# Altium project ThereMightBeNoise.PrjPCB (part 1 of 2)
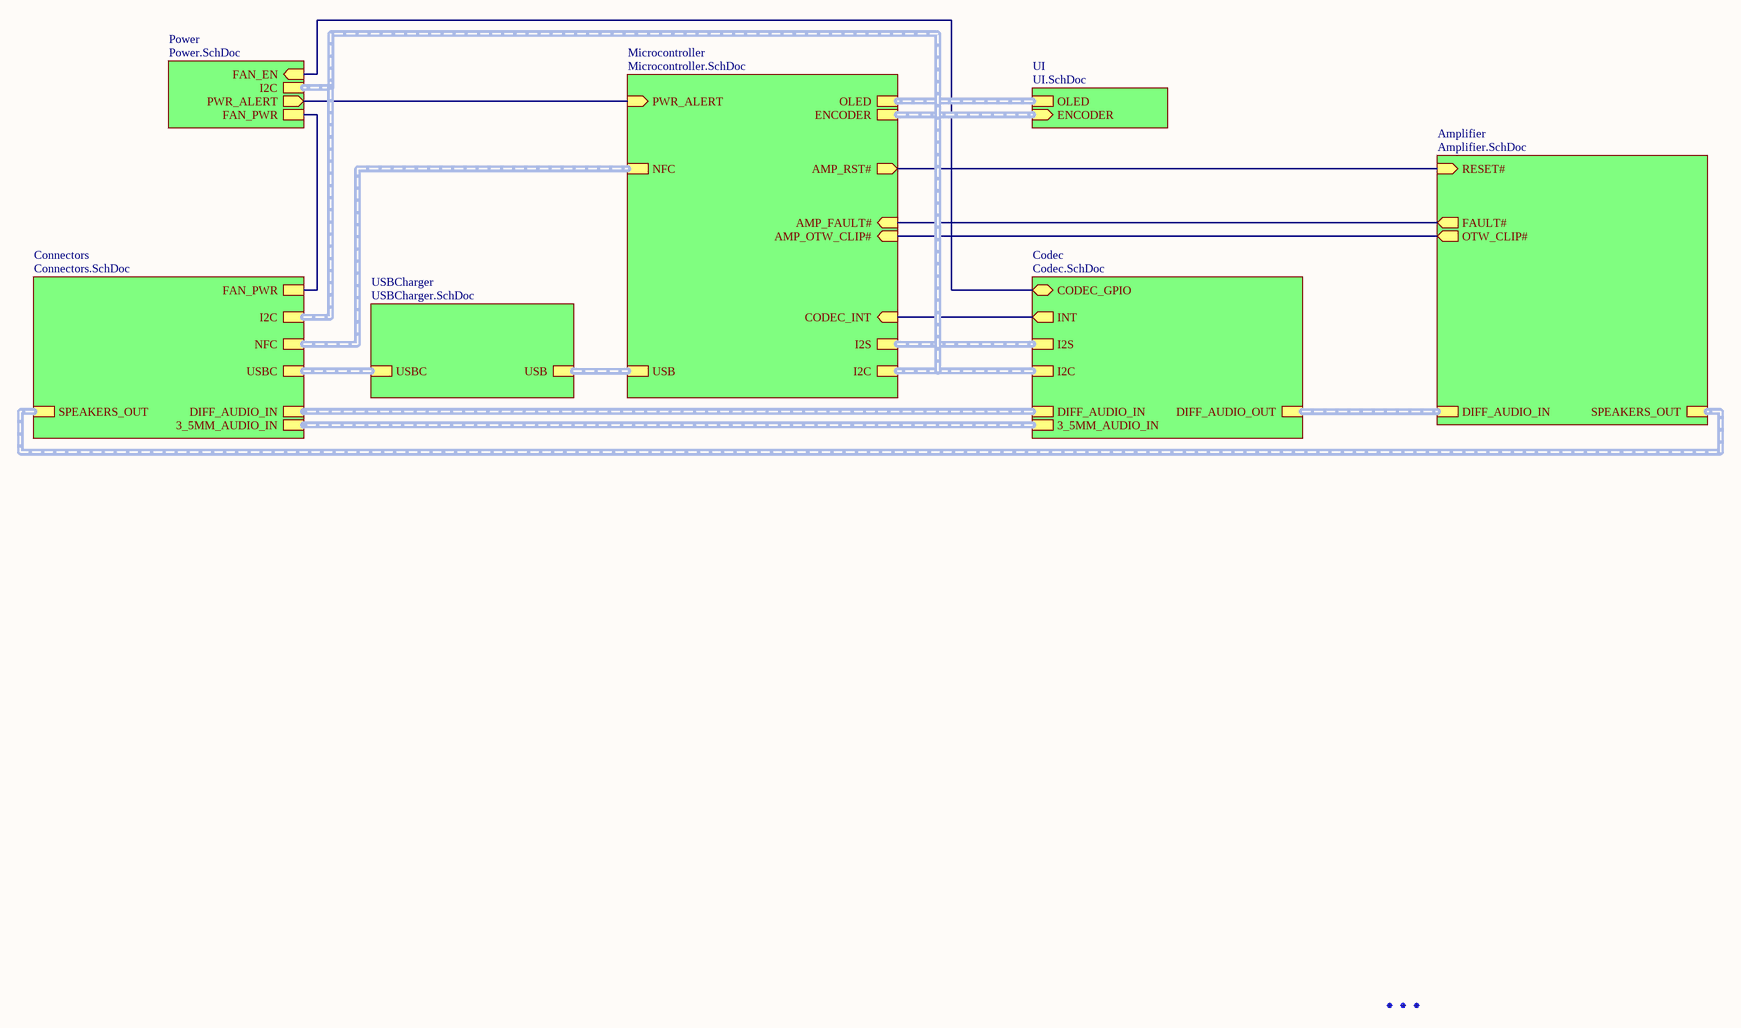
[diagram p0: ThereMightBeNoise.SchDoc]
ProjectAuthor: Danius Kalvaitis; ProjectNumber: dk_01017; ProjectRevision: v2.0; ProjectTitle: There Might Be Noise
9 sheets, 250 parts. Net scope: hierarchical (ports join the sheet entries above them; power ports are global).
Board file: ThereMightBeNoise.PcbDoc
Sheets:
  ThereMightBeNoise.SchDoc
    Microcontroller = Microcontroller.SchDoc
      U_nRF5340 = nRF5340.SchDoc
    Connectors = Connectors.SchDoc
    Codec = Codec.SchDoc
    Amplifier = Amplifier.SchDoc
    Power = Power.SchDoc
    UI = UI.SchDoc
    USBCharger = USBCharger.SchDoc

## Sheet ThereMightBeNoise.SchDoc: THERE MIGHT BE NOISE
size A3; DocumentNumber: 1; Revision: v1.0; SheetNumber: 1; SheetTotal: 9

### Parts
Fid1  Fiducial mark  [Fiducial]  (value not drawn)  (no BOM)
Fid2  Fiducial mark  [Fiducial]  (value not drawn)  (no BOM)
Fid3  Fiducial mark  [Fiducial]  (value not drawn)  (no BOM)

### Sub-sheets
Amplifier = Amplifier.SchDoc: SPEAKERS_OUT (harness DIFF_AUDIO), DIFF_AUDIO_IN (harness DIFF_AUDIO), FAULT# (out), OTW_CLIP# (out), RESET# (in)
Codec = Codec.SchDoc: DIFF_AUDIO_IN (harness DIFF_AUDIO), INT (out), DIFF_AUDIO_OUT (harness DIFF_AUDIO), I2S (harness I2S), I2C (harness I2C), 3_5MM_AUDIO_IN (harness 3_5MM_AUDIO), CODEC_GPIO (bidir)
Connectors = Connectors.SchDoc: USBC (harness USBC), DIFF_AUDIO_IN (harness DIFF_AUDIO), SPEAKERS_OUT (harness DIFF_AUDIO), 3_5MM_AUDIO_IN (harness 3_5MM_AUDIO), NFC (harness NFC), I2C (harness I2C), FAN_PWR
Microcontroller = Microcontroller.SchDoc: USB (harness USB), I2S (harness I2S), I2C (harness I2C), ENCODER (harness ENCODER), AMP_OTW_CLIP# (in), AMP_RST# (out), CODEC_INT (in), AMP_FAULT# (in), PWR_ALERT (in), NFC (harness NFC), OLED (harness OLED)
Power = Power.SchDoc: I2C (harness I2C), PWR_ALERT (out), FAN_EN (in), FAN_PWR
UI = UI.SchDoc: ENCODER (in, harness Encoder), OLED (harness OLED)
USBCharger = USBCharger.SchDoc: USBC (harness USBC), USB (harness USB)

### Nets
AMP_FAULT#: sheet Microcontroller/AMP_FAULT#, sheet Amplifier/FAULT#
AMP_OTW_CLIP#: sheet Microcontroller/AMP_OTW_CLIP#, sheet Amplifier/OTW_CLIP#
AMP_RST#: sheet Microcontroller/AMP_RST#, sheet Amplifier/RESET#
CODEC_GPIO: sheet Codec/CODEC_GPIO, sheet Power/FAN_EN
CODEC_INT: sheet Microcontroller/CODEC_INT, sheet Codec/INT
FAN_PWR: sheet Connectors/FAN_PWR, sheet Power/FAN_PWR
PWR_ALERT: sheet Microcontroller/PWR_ALERT, sheet Power/PWR_ALERT

### Buses and harness runs
harness sheet Amplifier/DIFF_AUDIO_IN = sheet Codec/DIFF_AUDIO_OUT
harness sheet Amplifier/SPEAKERS_OUT = sheet Connectors/SPEAKERS_OUT
harness sheet Codec/3_5MM_AUDIO_IN = sheet Connectors/3_5MM_AUDIO_IN
harness sheet Codec/DIFF_AUDIO_IN = sheet Connectors/DIFF_AUDIO_IN
harness sheet Codec/I2C = sheet Connectors/I2C = sheet Microcontroller/I2C = sheet Power/I2C
harness sheet Codec/I2S = sheet Microcontroller/I2S
harness sheet Connectors/NFC = sheet Microcontroller/NFC
harness sheet Connectors/USBC = sheet USBCharger/USBC
harness sheet Microcontroller/ENCODER = sheet UI/ENCODER
harness sheet Microcontroller/OLED = sheet UI/OLED
harness sheet Microcontroller/USB = sheet USBCharger/USB

### Notes on the sheet
- Title
- Date:
- Number:
- Revision:
- Sheet
- of
- File:
- Author

### Library data of the parts
Fid1-Fid3 = Fid-Mark

## Sheet Microcontroller.SchDoc
size A3; DocumentNumber: 8; SheetNumber: 8; SheetTotal: 9
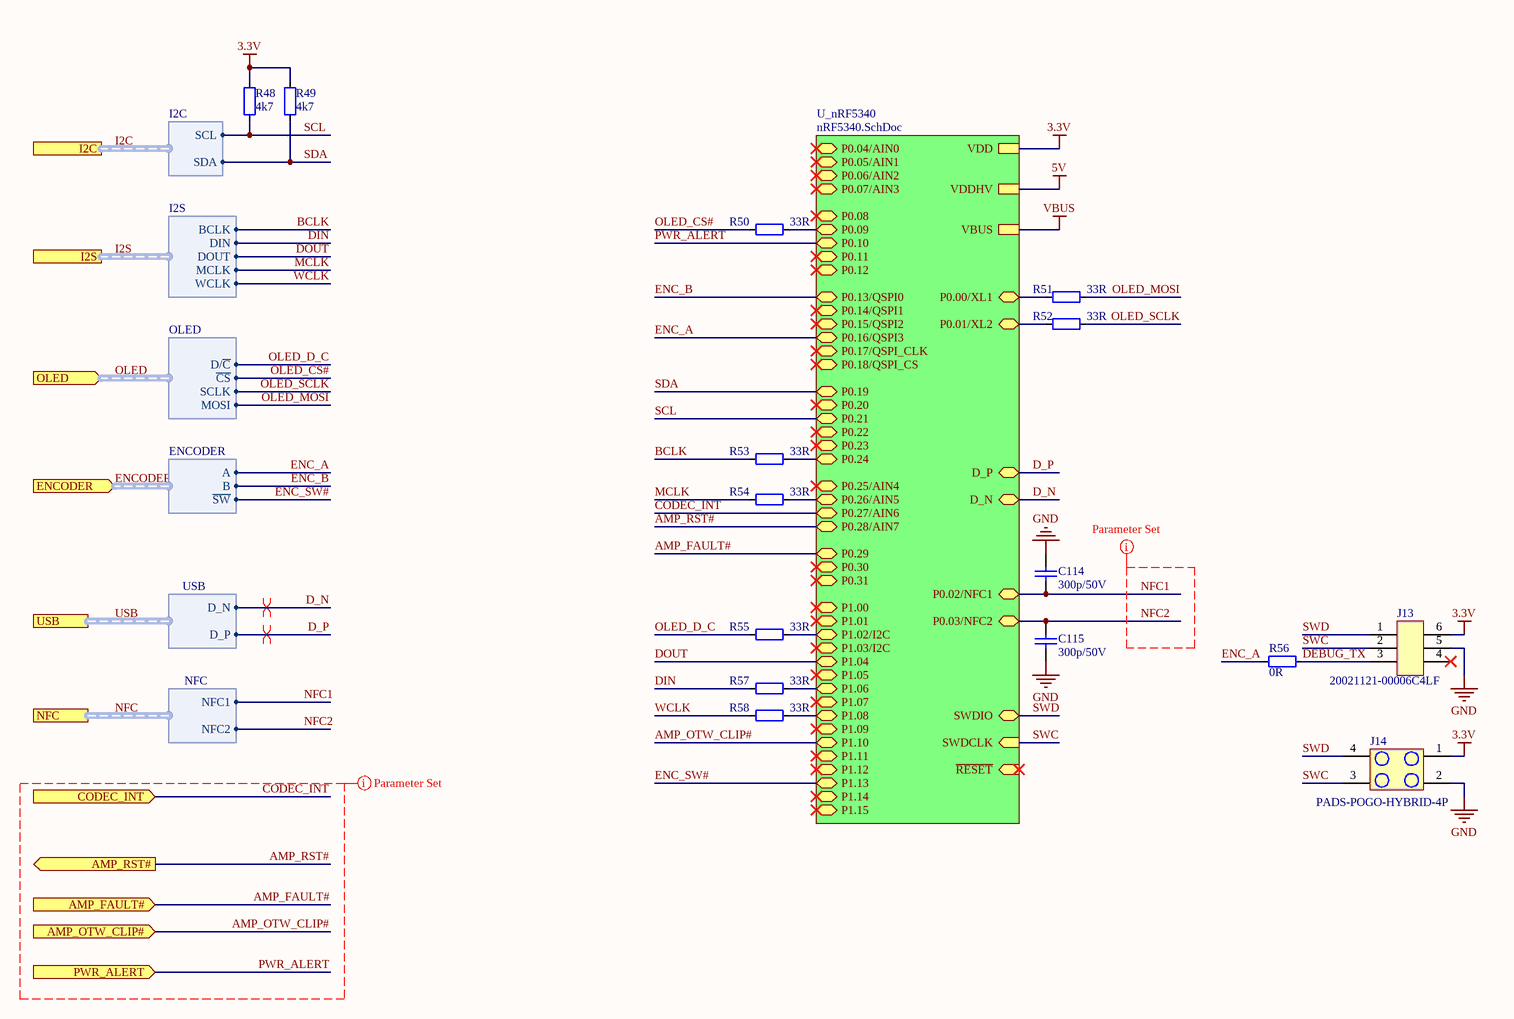
[diagram p1: Microcontroller.SchDoc]

### Parts
C114  300p/50V  [C0402]
C115  300p/50V  [C0402]
J13  20021121-00006C4LF  [20021121-00006C4LF]
J14  PADS-POGO-HYBRID-4P  [PADS-POGO-HYBRID-4P]
R48  4k7  [R0402]
R49  4k7  [R0402]
R50  33R  [R0402]
R51  33R  [R0402]
R52  33R  [R0402]
R53  33R  [R0402]
R54  33R  [R0402]
R55  33R  [R0402]
R56  0R  [R0402]
R57  33R  [R0402]
R58  33R  [R0402]

### Sub-sheets
U_nRF5340 = nRF5340.SchDoc: D_N (bidir), D_P (bidir), SWDIO (bidir), SWDCLK (in), P0.02/NFC1 (bidir), VDD, VDDHV, VBUS, ~{RESET} (in), P0.03/NFC2 (bidir), P0.04/AIN0 (bidir), P0.05/AIN1 (bidir), P0.06/AIN2 (bidir), P0.07/AIN3 (bidir), P0.08 (bidir), P0.09 (bidir), P0.10 (bidir), P0.11 (bidir), P0.12 (bidir), P0.13/QSPI0 (bidir), P0.14/QSPI1 (bidir), P0.15/QSPI2 (bidir), P0.16/QSPI3 (bidir), P0.17/QSPI_CLK (bidir), P0.18/QSPI_CS (bidir), P0.19 (bidir), P0.20 (bidir), P0.21 (bidir), P0.22 (bidir), P0.23 (bidir), P0.24 (bidir), P0.25/AIN4 (bidir), P0.26/AIN5 (bidir), P0.27/AIN6 (bidir), P0.28/AIN7 (bidir), P0.29 (bidir), P0.30 (bidir), P0.31 (bidir), P1.00 (bidir), P1.01 (bidir), P1.02/I2C (bidir), P1.03/I2C (bidir), P1.04 (bidir), P1.05 (bidir), P1.06 (bidir), P1.07 (bidir), P1.08 (bidir), P1.09 (bidir), P1.10 (bidir), P1.11 (bidir), P1.12 (bidir), P1.13 (bidir), P1.14 (bidir), P1.15 (bidir), P0.00/XL1 (bidir), P0.01/XL2 (bidir)

### Ports
AMP_FAULT# (in), AMP_OTW_CLIP# (in), AMP_RST# (out), CODEC_INT (in), ENCODER (in, harness ENCODER), I2C (harness I2C), I2S (harness I2S), NFC (harness NFC), OLED (in, harness OLED), PWR_ALERT (in), USB (harness USB)

### Harnesses
I2C: SCL, SDA
I2S: BCLK, DIN, DOUT, MCLK, WCLK
OLED: ~{CS}, D/~{C}, MOSI, SCLK
ENCODER: A, B, ~{SW}
USB: D_N, D_P
NFC: NFC1, NFC2

### Nets
3.3V: J13.6 J14.1 R48.2 R49.2 ; sheet U_nRF5340/VDD
GND: C114.2 C115.1 J13.5 J14.2
AMP_FAULT#: port AMP_FAULT#, sheet U_nRF5340/P0.29
AMP_OTW_CLIP#: port AMP_OTW_CLIP#, sheet U_nRF5340/P1.10
AMP_RST#: port AMP_RST#, sheet U_nRF5340/P0.28/AIN7
BCLK: R53.1 ; port I2S.BCLK  [project net I2S.BCLK]
CODEC_INT: port CODEC_INT, sheet U_nRF5340/P0.27/AIN6
D_N: sheet U_nRF5340/D_N, port USB.D_N  [project net USB.D_N]
D_P: sheet U_nRF5340/D_P, port USB.D_P  [project net USB.D_P]
DEBUG_TX: J13.3 R56.2  [project net DEBUG_TX_8]
DIN: R57.1 ; port I2S.DIN  [project net I2S.DIN]
DOUT: sheet U_nRF5340/P1.04, port I2S.DOUT  [project net I2S.DOUT]
ENC_A: R56.1 ; sheet U_nRF5340/P0.16/QSPI3, port ENCODER.A  [project net ENCODER.A]
ENC_B: sheet U_nRF5340/P0.13/QSPI0, port ENCODER.B  [project net ENCODER.B]
ENC_SW#: sheet U_nRF5340/P1.13, port ENCODER.~{SW}  [project net ENCODER.~{SW}]
MCLK: R54.1 ; port I2S.MCLK  [project net I2S.MCLK]
NFC1: C114.1 ; sheet U_nRF5340/P0.02/NFC1, port NFC.NFC1  [project net NFC.NFC1]
NFC2: C115.2 ; sheet U_nRF5340/P0.03/NFC2, port NFC.NFC2  [project net NFC.NFC2]
OLED_CS#: R50.1 ; port OLED.~{CS}  [project net OLED.~{CS}]
OLED_D_C: R55.1 ; port OLED.D/~{C}  [project net OLED.D/~{C}]
OLED_MOSI: R51.1 ; port OLED.MOSI  [project net OLED.MOSI]
OLED_SCLK: R52.1 ; port OLED.SCLK  [project net OLED.SCLK]
P0.00/XL1: R51.2 ; sheet U_nRF5340/P0.00/XL1
P0.01/XL2: R52.2 ; sheet U_nRF5340/P0.01/XL2
P0.09: R50.2 ; sheet U_nRF5340/P0.09
P0.24: R53.2 ; sheet U_nRF5340/P0.24
P0.26/AIN5: R54.2 ; sheet U_nRF5340/P0.26/AIN5
P1.02/I2C: R55.2 ; sheet U_nRF5340/P1.02/I2C
P1.06: R57.2 ; sheet U_nRF5340/P1.06
P1.08: R58.2 ; sheet U_nRF5340/P1.08
PWR_ALERT: port PWR_ALERT, sheet U_nRF5340/P0.10
SCL: R48.1 ; sheet U_nRF5340/P0.21, port I2C.SCL  [project net I2C.SCL]
SDA: R49.1 ; sheet U_nRF5340/P0.19, port I2C.SDA  [project net I2C.SDA]
SWC: J13.2 J14.3 ; sheet U_nRF5340/SWDCLK
SWD: J13.1 J14.4 ; sheet U_nRF5340/SWDIO
WCLK: R58.1 ; port I2S.WCLK  [project net I2S.WCLK]

Not connected (* = marked no-connect by the designer): J13 4*

### Buses and harness runs
harness ENCODER = port ENCODER
harness I2C = port I2C
harness I2S = port I2S
harness NFC = port NFC
harness OLED = port OLED
harness USB = port USB

### Layout directives
differential pair: USB.D_N, USB.D_P
net class DIGITAL_SIGNALS: AMP_FAULT#, AMP_OTW_CLIP#, AMP_RST#, CODEC_INT, PWR_ALERT
net class NFC: NFC1, NFC2

### Notes on the sheet
- Title
- Date:
- Number:
- Revision:
- Sheet
- of
- File:
- Author

### Library data of the parts
C114 C115 = 300p 50V X7R 0402: Manufacturer Part Number 1: CC0402KRX7R9BB301; Manufacturer 1: Yageo; Voltage: 50V; Tolerance: 10%; Specifications: X7R 300p 50V ±10%; Capacitance: 300p; Dielectric: X7R; Supplier 1: Mouser; Supplier Part Number 1: 603-CC0402KR9BB301
J13 = 20021121-00006C4LF: Connector Header Surface Mount 6 position 0.050" (1.27mm); Manufacturer 1: AMPHENOL ICC; Manufacturer Part Number 1: 20021121-00006C4LF; ComponentLink1Description: Datasheet; ComponentLink1URL: https://cdn.amphenol-icc.com/media/wysiwyg/files/drawing/20021121.pdf?__cf_chl_jschl_tk__=3dd5f28909d7b594ee28d46c9ed8f43700ae6f44-1596631605-0-ATkpzJL9TJu5FzfHdunZMmaqnR7r0Qv7snR3CT3UcrPbezJeDjnuGYEt9Icu5rIENpFvesAaxI1JprcOJqVCx--MldxHNP4cFD73HanaDcvKPajA5uzqtEkqfZFGs9vAT18J9ERX3JpJjT1NnL0Wpd_o0_HjBdrr38dsqxhFuKB3xDfcgAo_3Kc4TXKaTbGDXbsuVDNwVEquLSBLkUGRwDr4gRRD1vSEfgnEf5WjMvHMM99kTZrmwlUvHq_okpXBPoEm5lOyPGLHTIguALaj068LjevqrZNhKizCyxJfy6dRFp5Xmb_qgPb5HMl6zMfbZz-NLi2y3eDG5wjAfmg-LL4dpny0k2FZ_9MjdEs4MfLtzLiwnoMuDt3u_K_4OCKDYOPBmtEiCntVRR4GHwvceDo; Price @ 10k: 0.18; Supplier 1: Farnell; Supplier Part Number 1: 1865277
J14 = PADS-POGO-HYBRID-4P: Pads for 4 pin programming pogoor smd header; Manufacturer 1: AMPHENOL ICC; Manufacturer Part Number 1: 20021121-00004C4LF; Supplier 1: Farnell; Supplier Part Number 1: 1865276; ComponentLink1Description: Datasheet; ComponentLink1URL: https://www.farnell.com/cad/2354041.pdf
R48 R49 = 4k7 63mW 50V 0402: Manufacturer Part Number 1: AC0402FR-134K7L; Manufacturer 1: Yageo; Power Rating: 63mW; Tolerance: 1%; Voltage: 50V; Resistance: 4k7; Specifications: =Resistance+ ' '+"Power Rating "+Voltage+' ±'+Tolerance; Supplier 1: Mouser; Supplier Part Number 1: 603-AC0402FR-134K7L
R50-R55 R57 R58 = 33R 63mW 50V 0402: Manufacturer Part Number 1: CRCW040233R0JNEDC; Manufacturer 1: Vishay; Power Rating: 63mW; Tolerance: 5%; Voltage: 50V; Resistance: 33R; Specifications: =Resistance+ ' '+"Power Rating "+Voltage+' ±'+Tolerance; Supplier 1: Mouser; Supplier Part Number 1: 71-CRCW040233R0JNEDC
R56 = 0R 63mW 50V 0402: Manufacturer Part Number 1: CRCW04020000Z0EDC; Manufacturer 1: Vishay; Power Rating: 63mW; Tolerance: 1%; Voltage: 50V; Resistance: 0R; Specifications: =Resistance+ ' '+"Power Rating "+Voltage+' ±'+Tolerance; Supplier 1: Mouser; Supplier Part Number 1: 71-CRCW04020000Z0EDC

## Sheet nRF5340.SchDoc
size A3; DocumentNumber: 7; SheetNumber: 7; SheetTotal: 9
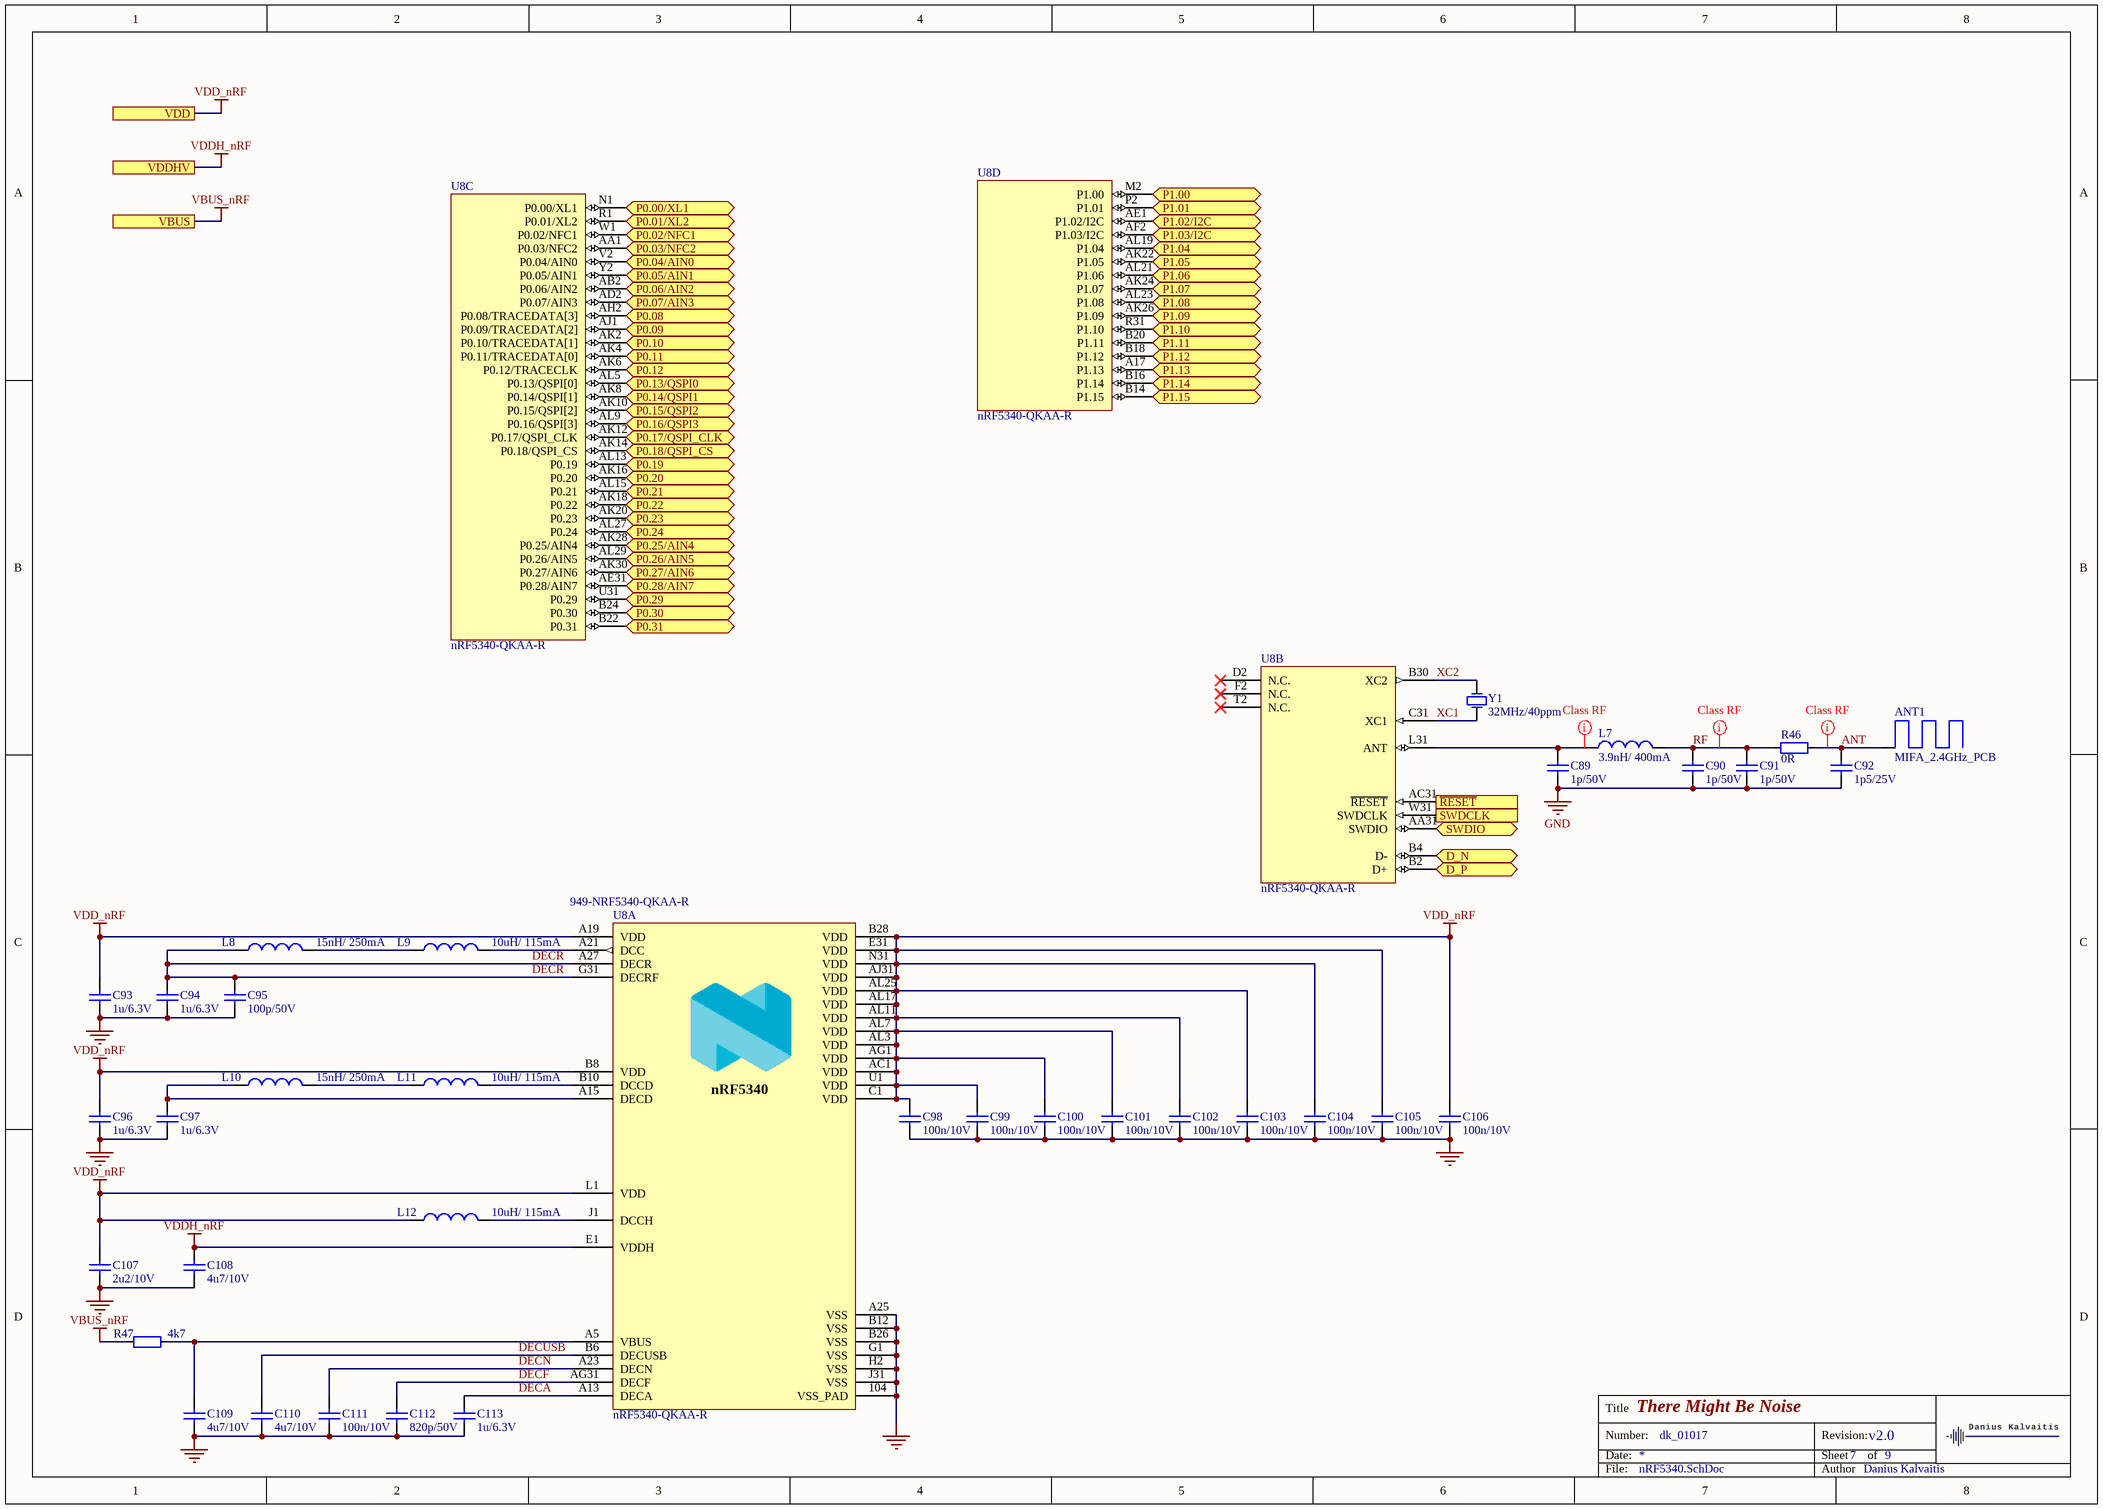
[diagram p2: nRF5340.SchDoc]

### Parts
ANT1  MIFA_2.4GHz_PCB  [MIFA_2.4GHz_PCB2]  (net tie, no BOM)
C89  1p/50V  [C0201]
C90  1p/50V  [C0201]
C91  1p/50V  [C0201]
C92  1p5/25V  [C0201]
C93  1u/6.3V  [C0402]
C94  1u/6.3V  [C0402]
C95  100p/50V  [C0201]
C96  1u/6.3V  [C0402]
C97  1u/6.3V  [C0402]
C98  100n/10V  [C0201]
C99  100n/10V  [C0201]
C100  100n/10V  [C0201]
C101  100n/10V  [C0201]
C102  100n/10V  [C0201]
C103  100n/10V  [C0201]
C104  100n/10V  [C0201]
C105  100n/10V  [C0201]
C106  100n/10V  [C0201]
C107  2u2/10V  [C0603]
C108  4u7/10V  [C0603]
C109  4u7/10V  [C0603]
C110  4u7/10V  [C0603]
C111  100n/10V  [C0201]
C112  820p/50V  [C0201]
C113  1u/6.3V  [C0402]
L7  3.9nH/ 400mA  [L0201]
L8  15nH/ 250mA  [L0201]
L9  10uH/ 115mA  [L0603]
L10  15nH/ 250mA  [L0201]
L11  10uH/ 115mA  [L0603]
L12  10uH/ 115mA  [L0603]
R46  0R  [R0201]
R47  4k7  [R0402]
U8  nRF5340-QKAA-R  Supplier Part Number 1: 949-NRF5340-QKAA-R  [AQFN-94]  (parts A,B,C,D of 4)
Y1  32MHz/40ppm  [XTAL_2X1_6]

### Ports
D_N (bidir), D_P (bidir), P0.00/XL1 (bidir), P0.01/XL2 (bidir), P0.02/NFC1 (bidir), P0.03/NFC2 (bidir), P0.04/AIN0 (bidir), P0.05/AIN1 (bidir), P0.06/AIN2 (bidir), P0.07/AIN3 (bidir), P0.08 (bidir), P0.09 (bidir), P0.10 (bidir), P0.11 (bidir), P0.12 (bidir), P0.13/QSPI0 (bidir), P0.14/QSPI1 (bidir), P0.15/QSPI2 (bidir), P0.16/QSPI3 (bidir), P0.17/QSPI_CLK (bidir), P0.18/QSPI_CS (bidir), P0.19 (bidir), P0.20 (bidir), P0.21 (bidir), P0.22 (bidir), P0.23 (bidir), P0.24 (bidir), P0.25/AIN4 (bidir), P0.26/AIN5 (bidir), P0.27/AIN6 (bidir), P0.28/AIN7 (bidir), P0.29 (bidir), P0.30 (bidir), P0.31 (bidir), P1.00 (bidir), P1.01 (bidir), P1.02/I2C (bidir), P1.03/I2C (bidir), P1.04 (bidir), P1.05 (bidir), P1.06 (bidir), P1.07 (bidir), P1.08 (bidir), P1.09 (bidir), P1.10 (bidir), P1.11 (bidir), P1.12 (bidir), P1.13 (bidir), P1.14 (bidir), P1.15 (bidir), SWDCLK (in), SWDIO (bidir), VBUS, VDD, VDDHV, ~{RESET} (in)

### Nets
GND: C89.1 C90.1 C91.1 C92.1 C93.1 C94.1 C95.1 C96.1 C97.1 C98.1 C99.1 C100.1 C101.1 C102.1 C103.1 C104.1 C105.1 C106.1 C107.1 C108.1 C109.1 C110.1 C111.1 C112.1 C113.1 U8.104(VSS_PAD) U8.A25(VSS) U8.B12(VSS) U8.B26(VSS) U8.G1(VSS) U8.H2(VSS) U8.J31(VSS)
VBUS_nRF: R47.1 ; port VBUS  [project net VBUS]
VDD_nRF: C93.2 C96.2 C98.2 C99.2 C100.2 C101.2 C102.2 C103.2 C104.2 C105.2 C106.2 C107.2 L12.1 U8.A19(VDD) U8.AC1(VDD) U8.AG1(VDD) U8.AJ31(VDD) U8.AL3(VDD) U8.AL7(VDD) U8.AL11(VDD) U8.AL17(VDD) U8.AL25(VDD) U8.B8(VDD) U8.B28(VDD) U8.C1(VDD) U8.E31(VDD) U8.L1(VDD) U8.N31(VDD) U8.U1(VDD) ; port VDD  [project net 3.3V]
VDDH_nRF: C108.2 U8.E1(VDDH) ; port VDDHV  [project net 5V]
AMP_FAULT#: U8.U31(P0.29) ; port P0.29
AMP_OTW_CLIP#: U8.R31(P1.10) ; port P1.10
AMP_RST#: U8.AE31(P0.28/AIN7) ; port P0.28/AIN7
ANT: ANT1.1 C92.2 R46.2  [project net ANT_7]
CODEC_INT: U8.AK30(P0.27/AIN6) ; port P0.27/AIN6
DECA: C113.2 U8.A13(DECA)  [project net DECA_7]
DECF: C112.2 U8.AG31(DECF)  [project net DECF_7]
DECN: C111.2 U8.A23(DECN)  [project net DECN_7]
DECR: C94.2 C95.2 L8.1 U8.A27(DECR) U8.G31(DECRF)  [project net DECR_7]
DECUSB: C110.2 U8.B6(DECUSB)  [project net DECUSB_7]
ENCODER.A: U8.AL9(P0.16/QSPI[3]) ; port P0.16/QSPI3
ENCODER.B: U8.AL5(P0.13/QSPI[0]) ; port P0.13/QSPI0
ENCODER.~{SW}: U8.A17(P1.13) ; port P1.13
I2C.SCL: U8.AL15(P0.21) ; port P0.21
I2C.SDA: U8.AL13(P0.19) ; port P0.19
I2S.DOUT: U8.AL19(P1.04) ; port P1.04
NFC.NFC1: U8.W1(P0.02/NFC1) ; port P0.02/NFC1
NFC.NFC2: U8.AA1(P0.03/NFC2) ; port P0.03/NFC2
P0.00/XL1: U8.N1(P0.00/XL1) ; port P0.00/XL1
P0.01/XL2: U8.R1(P0.01/XL2) ; port P0.01/XL2
P0.04/AIN0: U8.V2(P0.04/AIN0) ; port P0.04/AIN0
P0.05/AIN1: U8.Y2(P0.05/AIN1) ; port P0.05/AIN1
P0.06/AIN2: U8.AB2(P0.06/AIN2) ; port P0.06/AIN2
P0.07/AIN3: U8.AD2(P0.07/AIN3) ; port P0.07/AIN3
P0.08: U8.AH2(P0.08/TRACEDATA[3]) ; port P0.08
P0.09: U8.AJ1(P0.09/TRACEDATA[2]) ; port P0.09
P0.11: U8.AK4(P0.11/TRACEDATA[0]) ; port P0.11
P0.12: U8.AK6(P0.12/TRACECLK) ; port P0.12
P0.14/QSPI1: U8.AK8(P0.14/QSPI[1]) ; port P0.14/QSPI1
P0.15/QSPI2: U8.AK10(P0.15/QSPI[2]) ; port P0.15/QSPI2
P0.17/QSPI_CLK: U8.AK12(P0.17/QSPI_CLK) ; port P0.17/QSPI_CLK
P0.18/QSPI_CS: U8.AK14(P0.18/QSPI_CS) ; port P0.18/QSPI_CS
P0.20: U8.AK16(P0.20) ; port P0.20
P0.22: U8.AK18(P0.22) ; port P0.22
P0.23: U8.AK20(P0.23) ; port P0.23
P0.24: U8.AL27(P0.24) ; port P0.24
P0.25/AIN4: U8.AK28(P0.25/AIN4) ; port P0.25/AIN4
P0.26/AIN5: U8.AL29(P0.26/AIN5) ; port P0.26/AIN5
P0.30: U8.B24(P0.30) ; port P0.30
P0.31: U8.B22(P0.31) ; port P0.31
P1.00: U8.M2(P1.00) ; port P1.00
P1.01: U8.P2(P1.01) ; port P1.01
P1.02/I2C: U8.AE1(P1.02/I2C) ; port P1.02/I2C
P1.03/I2C: U8.AF2(P1.03/I2C) ; port P1.03/I2C
P1.05: U8.AK22(P1.05) ; port P1.05
P1.06: U8.AL21(P1.06) ; port P1.06
P1.07: U8.AK24(P1.07) ; port P1.07
P1.08: U8.AL23(P1.08) ; port P1.08
P1.09: U8.AK26(P1.09) ; port P1.09
P1.11: U8.B20(P1.11) ; port P1.11
P1.12: U8.B18(P1.12) ; port P1.12
P1.14: U8.B16(P1.14) ; port P1.14
P1.15: U8.B14(P1.15) ; port P1.15
PWR_ALERT: U8.AK2(P0.10/TRACEDATA[1]) ; port P0.10
~{RESET}: U8.AC31(~{RESET}) ; port ~{RESET}
RF: C90.2 C91.2 L7.2 R46.1  [project net RF_7]
SWC: U8.W31(SWDCLK) ; port SWDCLK
SWD: U8.AA31(SWDIO) ; port SWDIO
USB.D_N: U8.B4(D-) ; port D_N
USB.D_P: U8.B2(D+) ; port D_P
XC1: U8.C31(XC1) Y1.1  [project net XC1_7]
XC2: U8.B30(XC2) Y1.3  [project net XC2_7]
NetC89_2: C89.2 L7.1 U8.L31(ANT)
NetC97_2: C97.2 L10.1 U8.A15(DECD)
NetC109_2: C109.2 R47.2 U8.A5(VBUS)
NetL8_2: L8.2 L9.1
NetL9_2: L9.2 U8.A21(DCC)
NetL10_2: L10.2 L11.1
NetL11_2: L11.2 U8.B10(DCCD)
NetL12_2: L12.2 U8.J1(DCCH)

Not connected (* = marked no-connect by the designer): U8 D2(N.C.)* F2(N.C.)* T2(N.C.)*

### Layout directives
net class RF: ANT_7, NetC89_2, RF_7

### Notes on the sheet
- Title
- Date:
- Number:
- Revision:
- Sheet
- of
- File:
- Author
- (in symbol nRF5340-QKAA-R, part A) nRF5340

### Library data of the parts
ANT1 = MIFA_2.4GHz_PCB2: Meandered Inverted-F Antenna (MIFA)
C89-C91 = 1p 50V C0G 0201: Manufacturer Part Number 1: GRM0335C1H1R0BA01D; Manufacturer 1: MURATA; Voltage: 50V; Tolerance: 10%; Specifications: C0G 1p 50V ±10%; Capacitance: 1p; Dielectric: C0G; Supplier 1: Farnell; Supplier Part Number 1: 2990626
C92 = 1p5 25V C0G 0201: Manufacturer Part Number 1: GRM0335C1E1R5BA01D; Manufacturer 1: MURATA; Voltage: 25V; Tolerance: 7%; Specifications: C0G 1p5 25V ±7%; Capacitance: 1p5; Dielectric: C0G; Supplier 1: Farnell; Supplier Part Number 1: 2998131
C93 C94 C96 C97 C113 = 1u 6V3 X7R 0402: Manufacturer Part Number 1: GRM155R70J105KA12D; Manufacturer 1: MURATA; Voltage: 6.3V; Tolerance: 10%; Specifications: X7R 1u 6.3V ±10%; Capacitance: 1u; Dielectric: X7R; Supplier 1: Farnell; Supplier Part Number 1: 2688505
C95 = 100p 50V X7R 0201: Manufacturer Part Number 1: GRM033R71H101KA12D; Manufacturer 1: MURATA; Voltage: 50V; Tolerance: 10%; Specifications: X7R 100p 50V ±10%; Capacitance: 100p; Dielectric: X7R; Supplier 1: Farnell; Supplier Part Number 1: 2999557
C98-C106 C111 = 100n 10V X5R 0201: Manufacturer Part Number 1: CL03A104KP3NNNC; Manufacturer 1: Samsung; Voltage: 10V; Tolerance: 10%; Specifications: X5R 100n 10V ±10%; Capacitance: 100n; Dielectric: X5R; Supplier 1: Farnell; Supplier Part Number 1: 3013314
C107 = 2u2 10V X5R 0603: Manufacturer Part Number 1: CL10A225KP8NNNC; Manufacturer 1: SAMSUNG ELECTRO-MECHANICS; Voltage: 10V; Tolerance: 10%; Specifications: X5R 2u2 10V ±10%; Capacitance: 2u2; Dielectric: X5R; Supplier 1: Farnell; Supplier Part Number 1: 3013393
C108-C110 = 4u7 10V X5R 0603: Manufacturer Part Number 1: CL10A475KP8NNNC; Manufacturer 1: Samsung; Voltage: 10V; Tolerance: 10%; Specifications: X5R 4u7 10V ±10%; Capacitance: 4u7; Dielectric: X5R; Supplier 1: Farnell; Supplier Part Number 1: 3013398
C112 = 820p 50V X7R 0201: Manufacturer Part Number 1: GRM033R71H821KA12D; Manufacturer 1: MURATA; Voltage: 50V; Tolerance: 10%; Specifications: X7R 820p 50V ±10%; Capacitance: 820p; Dielectric: X7R; Supplier 1: Farnell; Supplier Part Number 1: 2999579
L7 = MLG0603P3N9ST000: Fixed Inductors IND 0201 3.9nH Hi-Q SMD RF IND; Manufacturer 1: TDK; Tolerance: 10%; Specifications: 3.9nH 400mA 10%; ComponentLink1Description: Datasheet; ComponentLink1URL: https://product.tdk.com/info/en/catalog/datasheets/inductor_commercial_high-frequency_mlg0603p_en.pdf?ref_disty=mouser; Inductance: 3.9nH; Current: 400mA; Manufacturer Part Number 1: MLG0603P3N9ST000; Supplier 1: Mouser; Supplier Part Number 1: 810-MLG0603P3N9ST000
L8 L10 = MLG0603P15NHT000: Fixed Inductors IND 0201 15nH Hi-Q SMD RF IND; Manufacturer 1: TDK; Tolerance: 3%; Specifications: 15nH 250mA 3%; ComponentLink1Description: Datasheet; ComponentLink1URL: https://product.tdk.com/info/en/catalog/datasheets/inductor_commercial_high-frequency_mlg0603p_en.pdf?ref_disty=mouser; Inductance: 15nH; Current: 250mA; Manufacturer Part Number 1: MLG0603P15NHT000; Supplier 1: Mouser; Supplier Part Number 1: 810-MLG0603P15NHT000
L9 L11 L12 = L0603B100KDWFT: Fixed Inductors 10uH 10% Wound Chip; Manufacturer 1: Kemet; Specifications: 10uH 115mA 10%; ComponentLink1Description: Datasheet; ComponentLink1URL: https://www.mouser.co.uk/datasheet/2/212/F3115-1104303.pdf; Inductance: 10uH; Tolerance: 10%; Current: 115mA; Manufacturer Part Number 1: L0603B100KDWFT; Supplier 1: Mouser; Supplier Part Number 1: 80-L0603B100KDWFT
R46 = 0R 50mW 25V 0201: Manufacturer Part Number 1: MCRE000086; Manufacturer 1: MULTICOMP PRO; Power Rating: 50mW; Tolerance: 1%; Voltage: 25V; Resistance: 0R; Specifications: =Resistance+ ' '+"Power Rating "+Voltage+' ±'+Tolerance; Supplier 1: Farnell; Supplier Part Number 1: 1711553
R47 = 4k7 63mW 50V 0402: as R48 on sheet Microcontroller; Resistance: 4k7; Specifications: =Resistance+ ' '+"Power Rating "+Voltage+' ±'+Tolerance; Supplier 1: Mouser; Supplier Part Number 1: 603-AC0402FR-134K7L
U8 = nRF5340-QKAA-R: Multi-protocol Bluetooth Low Energy, IEEE 802.15.4, ANT and 2.4GHz proprietary system-on-chip; Manufacturer 1: Nordic Semiconductor; ComponentLink1Description: Datasheet; ComponentLink1URL: https://www.mouser.co.uk/datasheet/2/297/nRF5340_OPS_v0_5_1-1929595.pdf; Manufacturer Part Number 1: nRF5340-QKAA-R; Supplier 1: Mouser
Y1 = XRCGB32M000FXH2CR0: Crystals 2x1.6mm 32MHz 40ppm Crystal Unit; Manufacturer 1: Murata Electronics; Load Capacitance: 8pF; Specifications: 32MHz  8pF 40ppm; Frequency: 32MHz; Tolerance: 40ppm; Manufacturer Part Number 1: XRCGB32M000FXH2CR0; ComponentLink1Description: Datasheets; ComponentLink1URL: https://www.mouser.co.uk/datasheet/2/281/SPEC-XRCGB32M000FXH2CR0-1879428.pdf; Supplier 1: Mouser; Supplier Part Number 1: 81-XRCGB32M000FXH2CR

## Sheet Connectors.SchDoc
size A3; DocumentNumber: 2; SheetNumber: 2; SheetTotal: 9
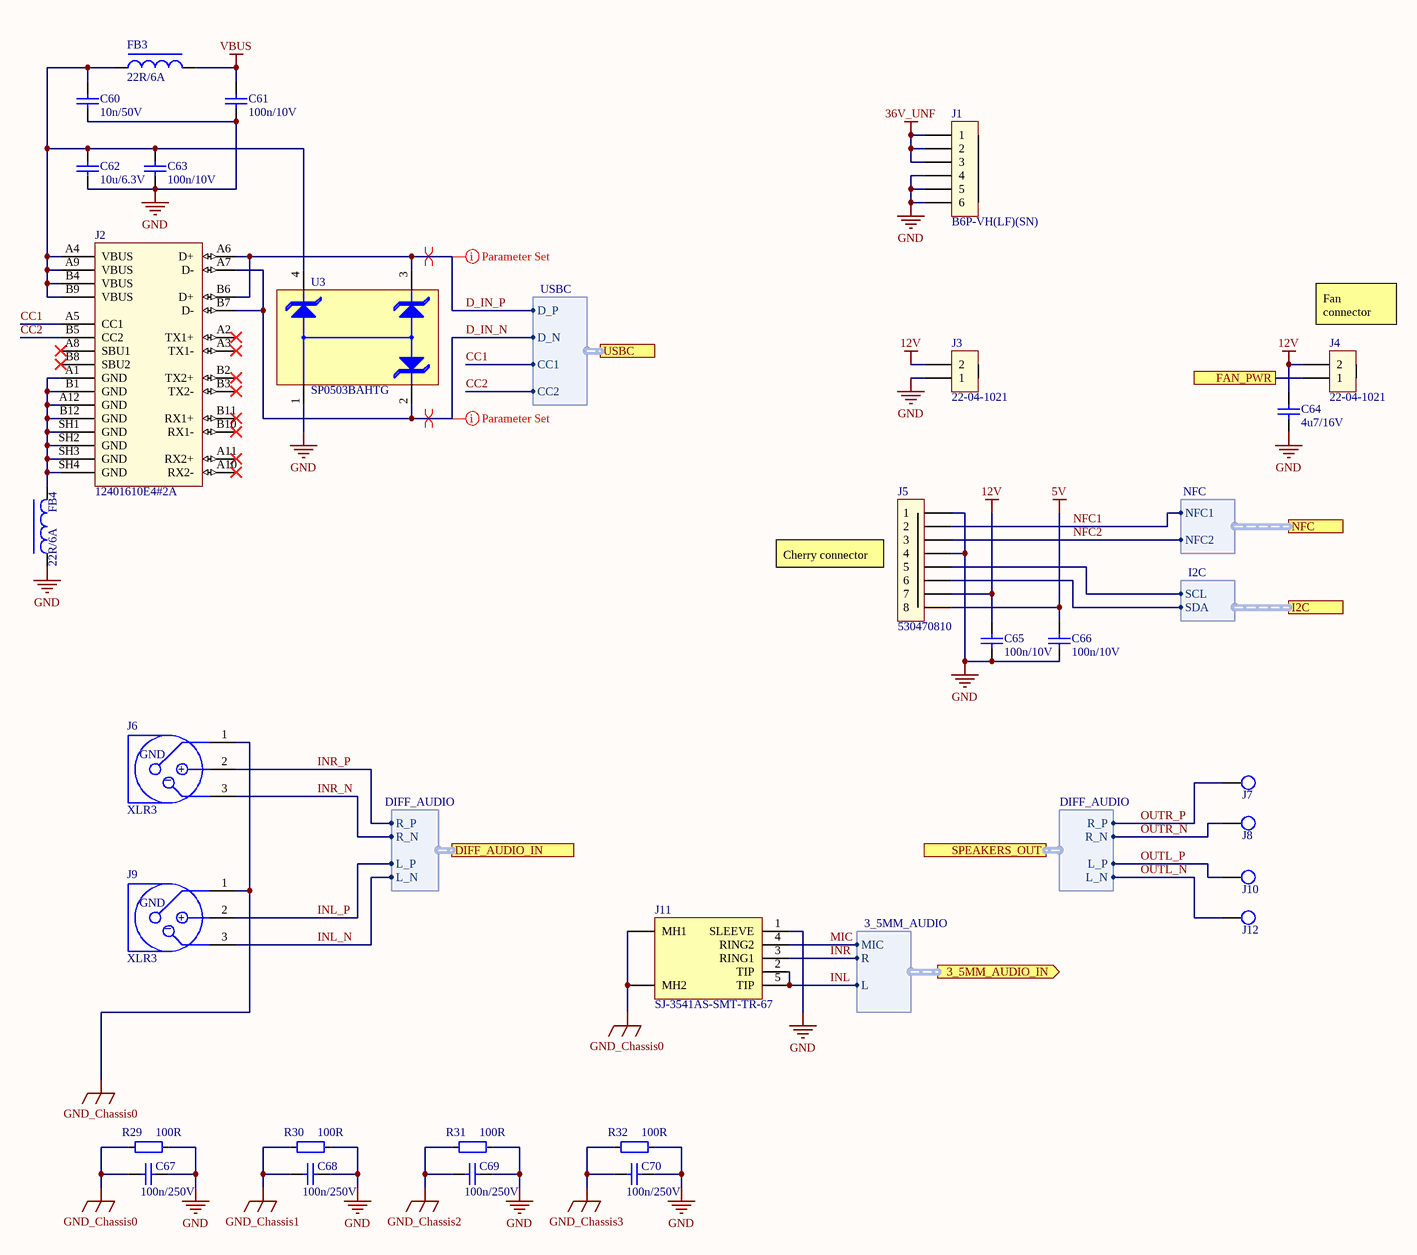
[diagram p3: Connectors.SchDoc]

### Parts
C60  10n/50V  [C0402]
C61  100n/10V  [C0402]
C62  10u/6.3V  [C0805]
C63  100n/10V  [C0402]
C64  4u7/16V  [C0805]
C65  100n/10V  [C0402]
C66  100n/10V  [C0402]
C67  100n/250V  [C1210]
C68  100n/250V  [C1210]
C69  100n/250V  [C1210]
C70  100n/250V  [C1210]
FB3  22R/6A  [FB0805]
FB4  22R/6A  [FB0805]
J1  B6P-VH(LF)(SN)  [B6P-VH]
J2  12401610E4#2A  [12401610E4#2A]
J3  22-04-1021  [22-04-1021]
J4  22-04-1021  [22-04-1021]
J5  530470810  [530470810]
J6  XLR3  [NC3FAAH1]
J7  AUDIO_JACK  [AUDIO_JACK_RED]  (value not drawn)
J8  AUDIO_JACK  [AUDIO_JACK_BLACK]  (value not drawn)
J9  XLR3  [NC3FAAH1]
J10  AUDIO_JACK  [AUDIO_JACK_RED]  (value not drawn)
J11  SJ-3541AS-SMT-TR-67  [SJ-3541AS-SMT-TR-67]
J12  AUDIO_JACK  [AUDIO_JACK_BLACK]  (value not drawn)
R29  100R  [R1206]
R30  100R  [R1206]
R31  100R  [R1206]
R32  100R  [R1206]
U3  SP0503BAHTG  [SOT143-4]

### Ports
3_5MM_AUDIO_IN (out, harness 3_5MM_AUDIO), DIFF_AUDIO_IN (harness DIFF_AUDIO), FAN_PWR, I2C (harness I2C), NFC (harness NFC), SPEAKERS_OUT (harness DIFF_AUDIO), USBC (harness USBC)

### Harnesses
USBC: D_P, D_N, CC1, CC2
DIFF_AUDIO: L_P, L_N, R_P, R_N
DIFF_AUDIO: L_N, L_P, R_N, R_P
3_5MM_AUDIO: R, L, MIC
NFC: NFC1, NFC2
I2C: SCL, SDA

### Nets
5V: C66.2 J5.8
12V: C64.2 C65.2 J3.2 J4.2 J5.7
36V_UNF: J1.1 J1.2 J1.3
GND: C60.1 C61.1 C62.1 C63.1 C64.1 C65.1 C66.1 C67.2 C68.2 C69.2 C70.2 FB4.1 J1.4 J1.5 J1.6 J3.1 J5.1 J5.4 J11.1(SLEEVE) R29.2 R30.2 R31.2 R32.2 U3.1
GND_Chassis0: C67.1 J6.1(GND) J9.1(GND) J11.MH1 J11.MH2 R29.1
GND_Chassis1: C68.1 R30.1
GND_Chassis2: C69.1 R31.1
GND_Chassis3: C70.1 R32.1
VBUS: C61.2 FB3.2
CC1: J2.A5(CC1) ; port USBC.CC1
CC2: J2.B5(CC2) ; port USBC.CC2
D_IN_N: J2.A7(D-) J2.B7(D-) U3.2 ; port USBC.D_N
D_IN_P: J2.A6(D+) J2.B6(D+) U3.3 ; port USBC.D_P
FAN_PWR: J4.1 ; port FAN_PWR
I2C.SCL: J5.5 ; port I2C.SCL
I2C.SDA: J5.6 ; port I2C.SDA
INL: J11.2(TIP) J11.5(TIP) ; port 3_5MM_AUDIO_IN.L
INL_N: J9.3(-) ; port DIFF_AUDIO_IN.L_N
INL_P: J9.2(+) ; port DIFF_AUDIO_IN.L_P
INR: J11.3(RING1) ; port 3_5MM_AUDIO_IN.R
INR_N: J6.3(-) ; port DIFF_AUDIO_IN.R_N
INR_P: J6.2(+) ; port DIFF_AUDIO_IN.R_P
MIC: J11.4(RING2) ; port 3_5MM_AUDIO_IN.MIC
NFC1: J5.2 ; port NFC.NFC1  [project net NFC.NFC1]
NFC2: J5.3 ; port NFC.NFC2  [project net NFC.NFC2]
OUTL_N: J12.1 ; port SPEAKERS_OUT.L_N
OUTL_P: J10.1 ; port SPEAKERS_OUT.L_P
OUTR_N: J8.1 ; port SPEAKERS_OUT.R_N
OUTR_P: J7.1 ; port SPEAKERS_OUT.R_P
NetC60_2: C60.2 C62.2 C63.2 FB3.1 J2.A4(VBUS) J2.A9(VBUS) J2.B4(VBUS) J2.B9(VBUS) U3.4
NetFB4_2: FB4.2 J2.A1(GND) J2.A12(GND) J2.B1(GND) J2.B12(GND) J2.SH1(GND) J2.SH2(GND) J2.SH3(GND) J2.SH4(GND)

Not connected (* = marked no-connect by the designer): J2 A2(TX1+)* A3(TX1-)* A8(SBU1)* A10(RX2-)* A11(RX2+)* B2(TX2+)* B3(TX2-)* B8(SBU2)* B10(RX1-)* B11(RX1+)*

### Layout directives
rule Impedance Constraint [Min = 80.00    Max = 100.0    ]: D_IN_N, D_IN_P
differential pair: D_IN_N, D_IN_P

### Notes on the sheet
- (near J4) Fan connector
- (near J5) Cherry connector
- Title
- Date:
- Number:
- Revision:
- Sheet
- of
- File:
- Author
- (in symbol NC3FAAH1) _

### Library data of the parts
C60 = 10n 50V X7R 0402: Manufacturer Part Number 1: 885012205067; Manufacturer 1: Wurth Elektronik; Voltage: 50V; Tolerance: 10%; Specifications: X7R 10n 50V ±10%; Capacitance: 10n; Dielectric: X7R; Supplier 1: Mouser; Supplier Part Number 1: 710-885012205067
C61 C63 C65 C66 = 100n 10V X5R 0402: Manufacturer Part Number 1: 885012105010; Manufacturer 1: Wurth Elektronik; Voltage: 10V; Tolerance: 20%; Specifications: X5R 100n 10V ±20%; Capacitance: 100n; Dielectric: X5R; Supplier 1: Mouser; Supplier Part Number 1: 710-885012105010
C62 = 10u 6V3 X7R 0805: Manufacturer Part Number 1: JMK212B7106KG-T; Manufacturer 1: Taiyo Yuden; Voltage: 6.3V; Tolerance: 10%; Specifications: X7R 10u 6.3V ±10%; Capacitance: 10u; Dielectric: X7R; Supplier 1: Mouser; Supplier Part Number 1: 963-JMK212B7106KG-T
C64 = 4u7 16V X7R 0805: Manufacturer Part Number 1: EMK212AB7475KGHT; Manufacturer 1: Taiyo Yuden; Voltage: 16V; Tolerance: 10%; Specifications: X7R 4u7 16V ±10%; Capacitance: 4u7; Dielectric: X7R; Supplier 1: Mouser; Supplier Part Number 1: 963-EMK212AB7475KGHT
C67-C70 = 100n 250V X7R 1206: Manufacturer Part Number 1: 885342208004; Manufacturer 1: Wurth Elektronik; Voltage: 250V; Tolerance: 10%; Specifications: X7R 100n 250V ±10%; Capacitance: 100n; Dielectric: X7R; Supplier 1: Mouser; Supplier Part Number 1: 710-885342208004
FB3 FB4 = BLM21PG220SN1D: 22 Ohms @ 100MHz 1 Power Line Ferrite Bead 0805 (2012 Metric) 6A 9mOhm; Specifications: 22R 6A 25%; Impedance: 22R; Resistance: 10mOhm; Tolerance: 25%; Manufacturer Part Number: BLM21PG220SN1D; Current: 6A; Supplier 1: Mouser; Supplier Part Number 1: 81-BLM21PG220SN1D; ComponentLink1Description: Datasheet; ComponentLink1URL: https://www.mouser.co.uk/datasheet/2/281/ENFA0005-1915781.pdf
J1 = B6P-VH(LF)(SN): Pin Header, Wire-to-Board, 3.96 mm, 1 Rows, 6 Contacts, Through Hole Straight, VH Series; Manufacturer 1: JST; ComponentLink1Description: Datasheet; ComponentLink1URL: http://www.farnell.com/datasheets/2578200.pdf; Manufacturer Part Number 1: B6P-VH(LF)(SN); Supplier 1: Farnell; Supplier Part Number 1: 2399166
J2 = 12401610E4#2A: USB Connectors USB TYPE C RCPT R/A SMT TOP MOUNT; Manufacturer 1: Amphenol; ComponentLink1Description: Datasheet; ComponentLink1URL: https://www.mouser.co.uk/datasheet/2/18/12401610e4x2a-1394819.pdf; Supplier 1: Mouser; Supplier Part Number 1: 523-12401610E4#2A; Manufacturer Part Number 1: 12401610E4#2A
J3 J4 = 22-04-1021: Pin Header, Wire-to-Board, 2.5 mm, 1 Rows, 2 Contacts, Through Hole Straight, KK 5045 Series; Manufacturer 1: Molex; Manufacturer Part Number 1: 22-04-1021; ComponentLink1Description: Datasheet; ComponentLink1URL: http://www.farnell.com/datasheets/1861359.pdf; Supplier 1: Farnell; Supplier Part Number 1: 9730940
J5 = 530470810: 1.25mm Pitch, PicoBlade PCB Header, Single Row, Vertical, Through Hole, Tin Plating, Friction Lock, 8 Circuits, Tray, 2.30mm PC Tail Length; Manufacturer 1: Molex; Manufacturer Part Number 1: 530470810; ComponentLink1Description: Datasheet; ComponentLink1URL: https://www.molex.com/webdocs/datasheets/pdf/en-us/0530470810_PCB_HEADERS.pdf; Supplier 1: Mouser; Supplier Part Number 1: 538-53047-0810
J6 J9 = NC3FAAH1: XLR Connectors 3P FEMALE HORIZ PIN 1 & GRD TOGETHER; Manufacturer 1: Neutrik; Supplier 1: Mouser; Supplier Part Number 1: 568-NC3FAAH-1; ComponentLink1Description: Datasheet; ComponentLink1URL: http://www.neutrik.us/en-us/xlr/aa-series/nc3faah1; Manufacturer Part Number 1: NC3FAAH1
J7 J8 J10 J12 = AUDIO_JACK: Speaker Spade Terminal Binding Post Metal Banana Plug Socket Connector; Supplier 1: Ebay; Supplier Part Number 1: https://www.ebay.co.uk/p/16004285643?iid=283347365473
J11 = SJ-3541AS-SMT-TR-67: 3.50mm (0.141", 1/8", Mini Plug) - Headphone Phone Jack 5 Conductor (TRRRS) Connector Solder; Manufacturer 1: CUI Devices; Supplier 1: Mouser; Supplier Part Number 1: 490-SJ-3541ASSMTTR67; ComponentLink1Description: Datasheet; ComponentLink1URL: https://www.cuidevices.com/product/resource/digikeypdf/sj-3541as-smt-tr-67.pdf; Manufacturer Part Number 1: SJ-3541AS-SMT-TR-67
R29-R32 = 100R 250mW 200V 1206: Manufacturer Part Number 1: CRCW1206100RFKEAC; Manufacturer 1: Vishay / Dale; Power Rating: 250mW; Tolerance: 1%; Voltage: 200V; Resistance: 100R; Specifications: =Resistance+ ' '+"Power Rating "+Voltage+' ±'+Tolerance; Supplier 1: Mouser; Supplier Part Number 1: 71-CRCW1206100RFKEAC
U3 = SP0503BAHTG: ESD Suppressors / TVS Diodes TVS AVAL DIODE SMT; Manufacturer 1: Littlefuse; Breakdown Voltage: 5.5V; Diode Capacitance: 30pF; Power Dissipation: 225mW; Specifications: 5.5V 30pF 225mW; ComponentLink1Description: Datasheet; ComponentLink1URL: https://www.mouser.co.uk/datasheet/2/240/Littelfuse_TVS_Diode_Array_SP05_Datasheet.pdf-777043.pdf; Stock: 8366; Supplier 1: Mouser; Supplier Part Number 1: 576-SP0503BAHTG; Manufacturer Part Number 1: SP0503BAHTG

## Sheet Codec.SchDoc
size A3; DocumentNumber: 3; SheetNumber: 3; SheetTotal: 9
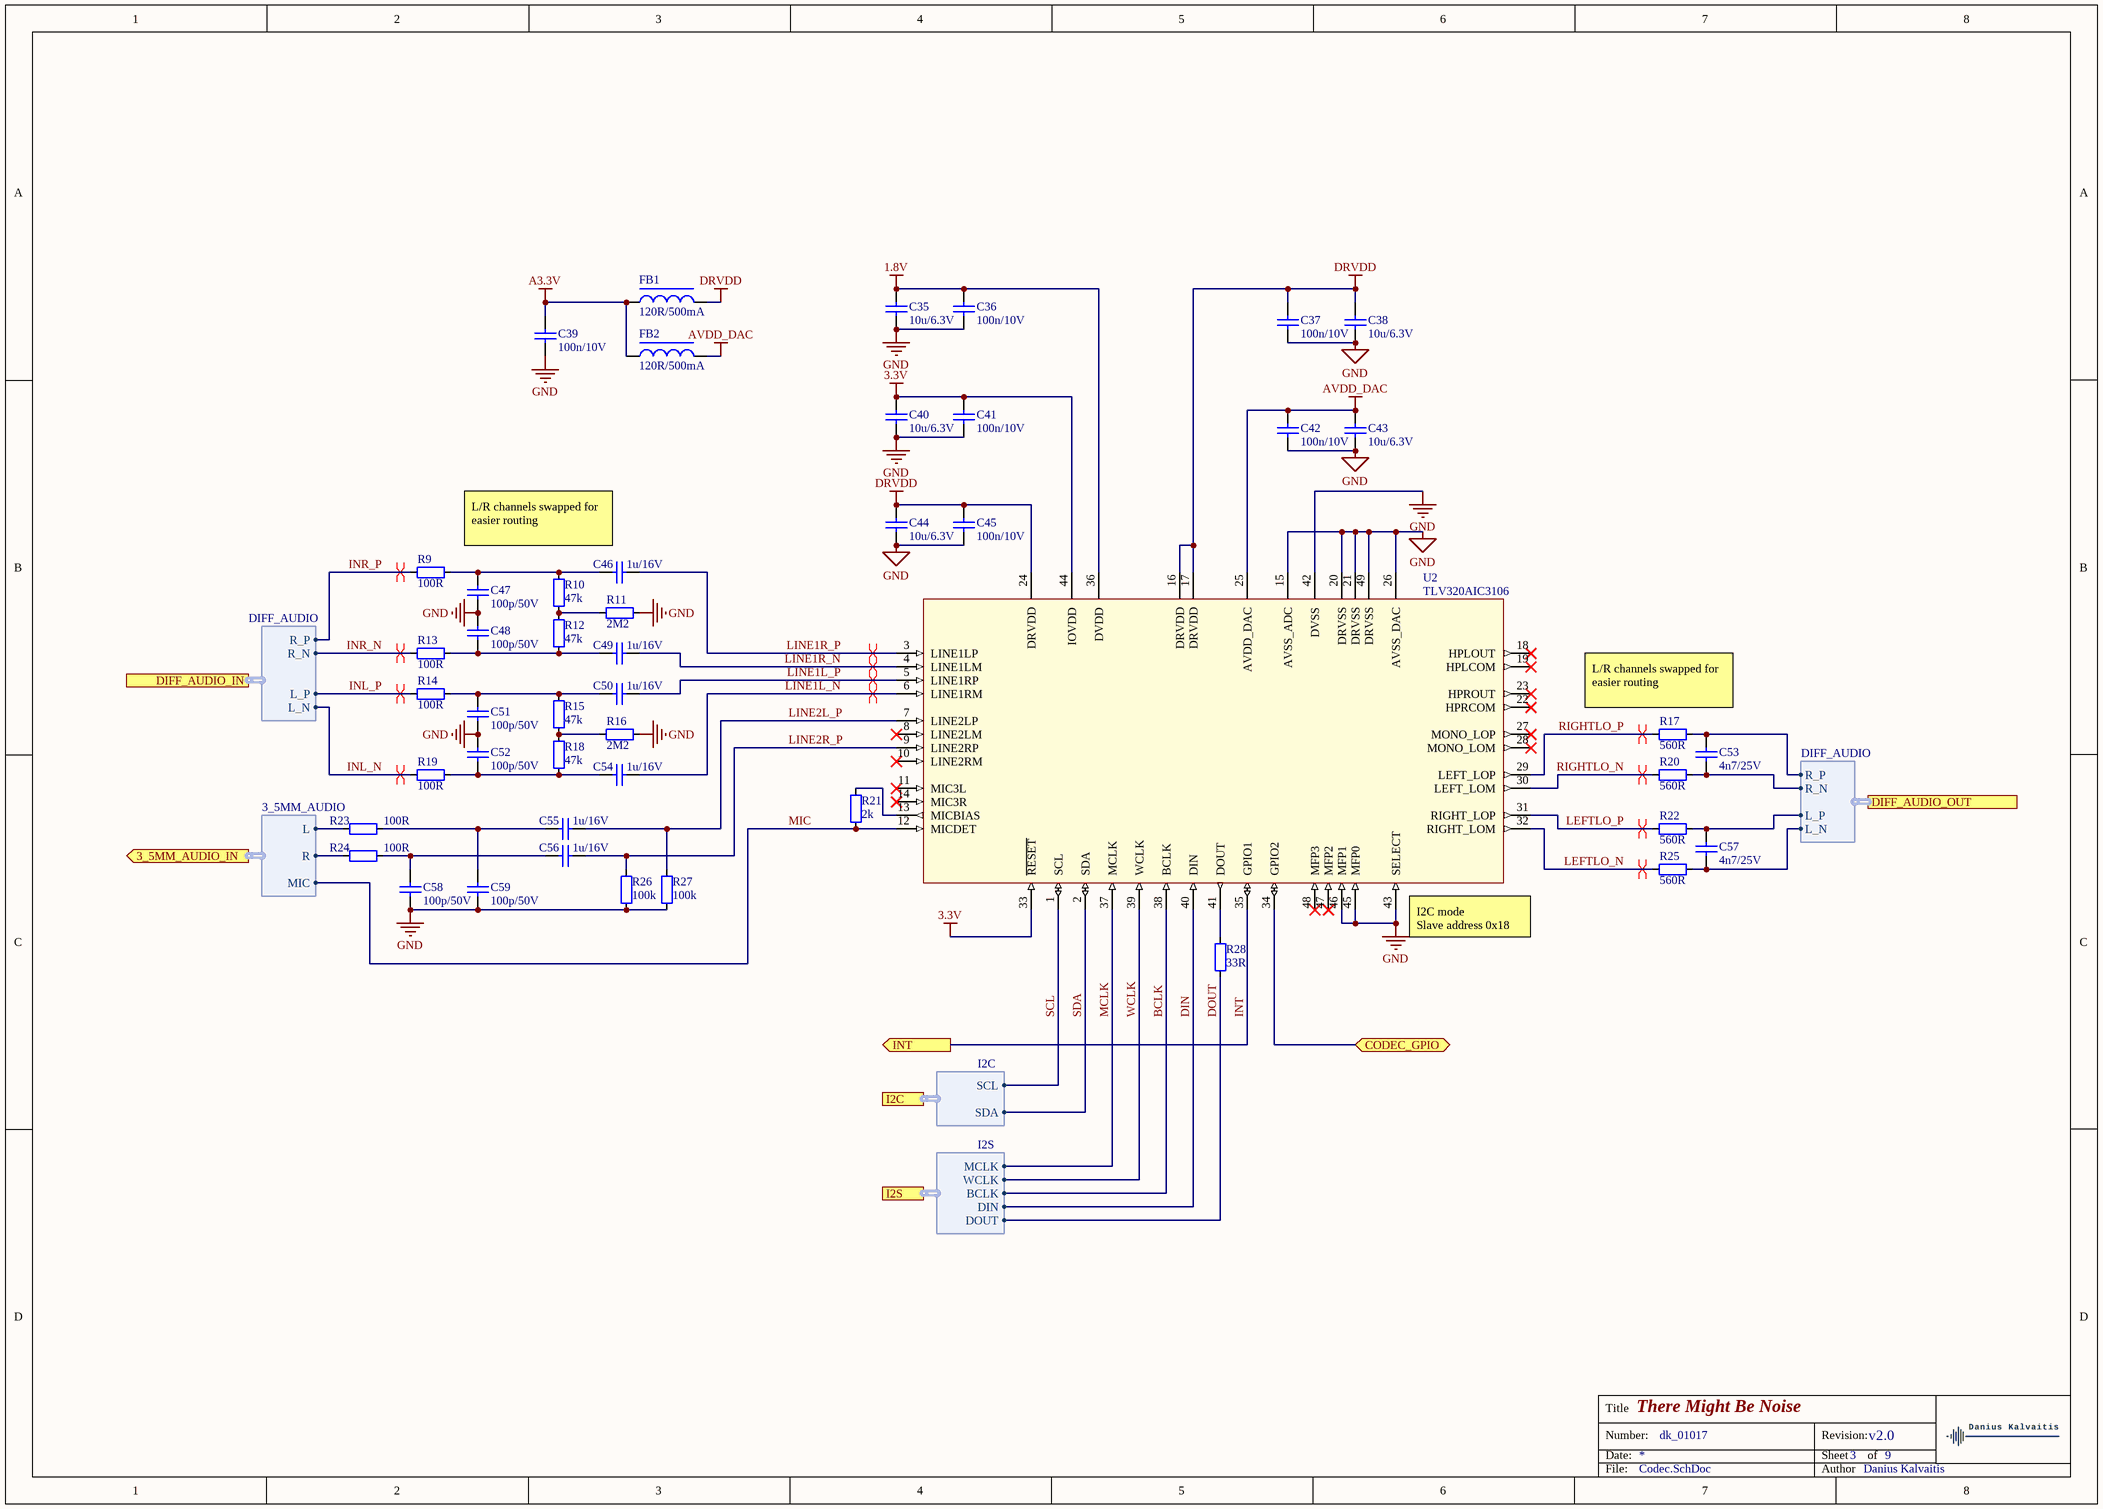
[diagram p4: Codec.SchDoc]

### Parts
C35  10u/6.3V  [C0805]
C36  100n/10V  [C0402]
C37  100n/10V  [C0402]
C38  10u/6.3V  [C0805]
C39  100n/10V  [C0402]
C40  10u/6.3V  [C0805]
C41  100n/10V  [C0402]
C42  100n/10V  [C0402]
C43  10u/6.3V  [C0805]
C44  10u/6.3V  [C0805]
C45  100n/10V  [C0402]
C46  1u/16V  [C0603]
C47  100p/50V  [C0402]
C48  100p/50V  [C0402]
C49  1u/16V  [C0603]
C50  1u/16V  [C0603]
C51  100p/50V  [C0402]
C52  100p/50V  [C0402]
C53  4n7/25V  [C0402]
C54  1u/16V  [C0603]
C55  1u/16V  [C0603]
C56  1u/16V  [C0603]
C57  4n7/25V  [C0402]
C58  100p/50V  [C0402]
C59  100p/50V  [C0402]
FB1  120R/500mA  [FB0402]
FB2  120R/500mA  [FB0402]
R9  100R  [R0402]
R10  47k  [R0402]
R11  2M2  [R0402]
R12  47k  [R0402]
R13  100R  [R0402]
R14  100R  [R0402]
R15  47k  [R0402]
R16  2M2  [R0402]
R17  560R  [R0402]
R18  47k  [R0402]
R19  100R  [R0402]
R20  560R  [R0402]
R21  2k  [R0402]
R22  560R  [R0402]
R23  100R  [R0402]
R24  100R  [R0402]
R25  560R  [R0402]
R26  100k  [R0402]
R27  100k  [R0402]
R28  33R  [R0402]
U2  TLV320AIC3106  [VQFN-48]

### Ports
3_5MM_AUDIO_IN (out, harness 3_5MM_AUDIO), CODEC_GPIO (bidir), DIFF_AUDIO_IN (harness DIFF_AUDIO), DIFF_AUDIO_OUT (harness DIFF_AUDIO), I2C (harness I2C), I2S (harness I2S), INT (out)

### Harnesses
DIFF_AUDIO: L_N, L_P, R_N, R_P
I2C: SCL, SDA
I2S: MCLK, WCLK, BCLK, DIN, DOUT
3_5MM_AUDIO: R, L, MIC

### Nets
1.8V: C35.2 C36.2 U2.36(DVDD)
3.3V: C40.2 C41.2 U2.33(~{RESET}) U2.44(IOVDD)
A3.3V: C39.2 FB1.1 FB2.1
AVDD_DAC: C42.2 C43.2 FB2.2 U2.25(AVDD_DAC)
DRVDD: C37.2 C38.2 C44.2 C45.2 FB1.2 U2.16(DRVDD) U2.17(DRVDD) U2.24(DRVDD)
GND: C35.1 C36.1 C37.1 C38.1 C39.1 C40.1 C41.1 C42.1 C43.1 C44.1 C45.1 C47.1 C48.2 C51.1 C52.2 C58.1 C59.1 R11.2 R16.2 R26.1 R27.1 U2.15(AVSS_ADC) U2.20(DRVSS) U2.21(DRVSS) U2.26(AVSS_DAC) U2.42(DVSS) U2.43(SELECT) U2.45(MFP0) U2.46(MFP1) U2.49(DRVSS)
BCLK: U2.38(BCLK) ; port I2S.BCLK  [project net I2S.BCLK]
CODEC_GPIO: U2.34(GPIO2) ; port CODEC_GPIO
DIN: U2.40(DIN) ; port I2S.DIN  [project net I2S.DIN]
DOUT: R28.1 ; port I2S.DOUT  [project net I2S.DOUT]
INL: R23.1 ; port 3_5MM_AUDIO_IN.L
INL_N: R19.1 ; port DIFF_AUDIO_IN.L_N
INL_P: R14.1 ; port DIFF_AUDIO_IN.L_P
INR: R24.1 ; port 3_5MM_AUDIO_IN.R
INR_N: R13.1 ; port DIFF_AUDIO_IN.R_N
INR_P: R9.1 ; port DIFF_AUDIO_IN.R_P
INT: U2.35(GPIO1) ; port INT  [project net CODEC_INT]
LEFTLO_N: R25.1 U2.32(RIGHT_LOM)  [project net LEFTLO_N_3]
LEFTLO_P: R22.1 U2.31(RIGHT_LOP)  [project net LEFTLO_P_3]
LINE1L_N: C54.1 U2.6(LINE1RM)  [project net LINE1L_N_3]
LINE1L_P: C50.1 U2.5(LINE1RP)  [project net LINE1L_P_3]
LINE1R_N: C49.1 U2.4(LINE1LM)  [project net LINE1R_N_3]
LINE1R_P: C46.1 U2.3(LINE1LP)  [project net LINE1R_P_3]
LINE2L_P: C55.1 R27.2 U2.7(LINE2LP)  [project net LINE2L_P_3]
LINE2R_P: C56.1 R26.2 U2.9(LINE2RP)  [project net LINE2R_P_3]
MCLK: U2.37(MCLK) ; port I2S.MCLK  [project net I2S.MCLK]
MIC: R21.1 U2.12(MICDET) ; port 3_5MM_AUDIO_IN.MIC
RIGHTLO_N: R20.1 U2.30(LEFT_LOM)  [project net RIGHTLO_N_3]
RIGHTLO_P: R17.1 U2.29(LEFT_LOP)  [project net RIGHTLO_P_3]
SCL: U2.1(SCL) ; port I2C.SCL  [project net I2C.SCL]
SDA: U2.2(SDA) ; port I2C.SDA  [project net I2C.SDA]
WCLK: U2.39(WCLK) ; port I2S.WCLK  [project net I2S.WCLK]
NetC8_1: C53.2 R17.2 ; port DIFF_AUDIO_OUT.R_P
NetC11_1: C53.1 R20.2 ; port DIFF_AUDIO_OUT.R_N
NetC16_1: C57.2 R22.2 ; port DIFF_AUDIO_OUT.L_P
NetC20_1: C57.1 R25.2 ; port DIFF_AUDIO_OUT.L_N
NetC46_2: C46.2 C47.2 R9.2 R10.2
NetC48_1: C48.1 C49.2 R12.1 R13.2
NetC50_2: C50.2 C51.2 R14.2 R15.2
NetC52_1: C52.1 C54.2 R18.1 R19.2
NetC55_2: C55.2 C59.2 R23.2
NetC56_2: C56.2 C58.2 R24.2
NetR10_1: R10.1 R11.1 R12.2
NetR15_1: R15.1 R16.1 R18.2
NetR21_2: R21.2 U2.13(MICBIAS)
NetR28_2: R28.2 U2.41(DOUT)

Not connected (* = marked no-connect by the designer): U2 8(LINE2LM)* 10(LINE2RM)* 11(MIC3L)* 14(MIC3R)* 18(HPLOUT)* 19(HPLCOM)* 22(HPRCOM)* 23(HPROUT)* 27(MONO_LOP)* 28(MONO_LOM)* 47(MFP2)* 48(MFP3)*

### Layout directives
differential pair: INL_N, INL_P, INR_N, INR_P, LEFTLO_N_3, LEFTLO_P_3, LINE1L_N_3, LINE1L_P_3, LINE1R_N_3, LINE1R_P_3, RIGHTLO_N_3, RIGHTLO_P_3

### Notes on the sheet
- L/R channels swapped for easier routing
- (near U2) I2C mode
  Slave address 0x18
- Title
- Date:
- Number:
- Revision:
- Sheet
- of
- File:
- Author

### Library data of the parts
C35 C38 C40 C43 C44 = 10u 6V3 X7R 0805: as C62 on sheet Connectors; Supplier 1: Mouser; Supplier Part Number 1: 963-JMK212B7106KG-T
C36 C37 C39 C41 C42 C45 = 100n 10V X5R 0402: as C61 on sheet Connectors; Supplier 1: Mouser; Supplier Part Number 1: 710-885012105010
C46 C49 C50 C54-C56 = 1u 16V X7R 0603: Manufacturer Part Number 1: 885012206052; Manufacturer 1: Wurth Elektronik; Voltage: 16V; Tolerance: 10%; Specifications: X7R 1u 16V ±10%; Capacitance: 1u; Dielectric: X7R; Supplier 1: Mouser; Supplier Part Number 1: 710-885012206052
C47 C48 C51 C52 C58 C59 = 100p 50V C0G 0402: Manufacturer Part Number 1: MC0402N101K500CT; Manufacturer 1: Multicomp PRO; Voltage: 50V; Tolerance: 10%; Specifications: C0G 100p 50V ±10%; Capacitance: 100p; Dielectric: C0G; Supplier 1: Farnell; Supplier Part Number 1: 2320762
C53 C57 = 4n7 25V X7R 0402: Manufacturer Part Number 1: 885012205048; Manufacturer 1: Wurth Elektronik; Voltage: 25V; Tolerance: 10%; Specifications: X7R 4n7 25V ±10%; Capacitance: 4n7; Dielectric: X7R; Supplier 1: Mouser; Supplier Part Number 1: 710-885012205048
FB1 FB2 = BLM15AG121SN1D: 120 Ohms @ 100MHz 1  Ferrite Bead 0402 (1005 Metric) 550mA 190mOhm; Specifications: 120R 500mA 25%; Impedance: 120R; Current: 500mA; Resistance: 250mOhm; Tolerance: 25%; Manufacturer Part Number: BLM15AG121SN1D; Supplier 1: Mouser; Supplier Part Number 1: 81-BLM15AG121SN1D; ComponentLink1Description: Datasheet; ComponentLink1URL: https://www.murata.com/en-us/products/productdata/8796740059166/ENFA0018.pdf
R9 R13 R14 R19 R23 R24 = 100R 63mW 50V 0402: Manufacturer Part Number 1: MCWR04X1000FTL; Manufacturer 1: MULTICOMP PRO; Power Rating: 63mW; Tolerance: 1%; Voltage: 50V; Resistance: 100R; Specifications: =Resistance+ ' '+"Power Rating "+Voltage+' ±'+Tolerance; Supplier 1: Farnell; Supplier Part Number 1: 2447095
R10 R12 R15 R18 = 47k 63mW 50V 0402: Manufacturer Part Number 1: MCWR04X4702FTL; Manufacturer 1: MULTICOMP PRO; Power Rating: 63mW; Tolerance: 1%; Voltage: 50V; Resistance: 47k; Specifications: =Resistance+ ' '+"Power Rating "+Voltage+' ±'+Tolerance; Supplier 1: Farnell; Supplier Part Number 1: 2447179
R11 R16 = 2M2 63mW 50V 0402: Manufacturer Part Number 1: MCWR04W2204FTL; Manufacturer 1: MULTICOMP PRO; Power Rating: 63mW; Tolerance: 1%; Voltage: 50V; Resistance: 2M2; Specifications: =Resistance+ ' '+"Power Rating "+Voltage+' ±'+Tolerance; Supplier 1: Farnell; Supplier Part Number 1: 2447153
R17 R20 R22 R25 = 560R 63mW 50V 0402: Manufacturer Part Number 1: ERJ-2RHD5600X; Manufacturer 1: Panasonic; Power Rating: 63mW; Tolerance: 0.5%; Voltage: 50V; Resistance: 560R; Specifications: =Resistance+ ' '+"Power Rating "+Voltage+' ±'+Tolerance; Supplier 1: Mouser; Supplier Part Number 1: 667-ERJ-2RHD5600X
R21 = 2k 63mW 50V 0402: Manufacturer Part Number 1: MCWR04X2001FTL; Manufacturer 1: MULTICOMP PRO; Power Rating: 63mW; Tolerance: 1%; Voltage: 50V; Resistance: 2k; Specifications: =Resistance+ ' '+"Power Rating "+Voltage+' ±'+Tolerance; Supplier 1: Farnell; Supplier Part Number 1: 2447147
R26 R27 = 100k 63mW 50V 0402: Manufacturer Part Number 1: AC0402FR-07100KL; Manufacturer 1: Yageo; Power Rating: 63mW; Tolerance: 1%; Voltage: 50V; Resistance: 100k; Specifications: =Resistance+ ' '+"Power Rating "+Voltage+' ±'+Tolerance; Supplier 1: Mouser; Supplier Part Number 1: 603-AC0402FR-07100KL
R28 = 33R 63mW 50V 0402: as R50 on sheet Microcontroller; Resistance: 33R; Specifications: =Resistance+ ' '+"Power Rating "+Voltage+' ±'+Tolerance; Supplier 1: Mouser; Supplier Part Number 1: 71-CRCW040233R0JNEDC
U2 = TLV320AIC3106: TLV320AIC3106 Low-Power Stereo Audio CODEC for Portable Audio/Telephony; Manufacturer Part Number: TLV320AIC3106IRGZR; Manufacturer 1: Texas Instruments; ComponentLink1Description: Datasheet; ComponentLink1URL: http://www.ti.com/lit/ds/symlink/tlv320aic3106.pdf; Supplier 1: Mouser; Supplier Part Number 1: 595-V320AIC3106IRGZR; Manufacturer Part Number 1: TLV320AIC3106IRGZR; Supplier 2: Ebay; Supplier Part Number 2: https://www.ebay.com/itm/314119689693?hash=item4922fe15dd:g:~7UAAOSwOKRjB0jY&amdata=enc%3AAQAHAAAA4N0kf08Ubw6PpxJ0sV6%2Fq4sxEvBHfILYZT9O%2B3R2ik8SIpR8dyoOz6b3zf4RdB22lZOPJxKqmbMyCk7qr01zOZpZNXsi5rvSdRqY841zB7LnX0sY0vu1g%2BBVDZfZajFxEp3dD2ONrEfVXD5wqt9NyzT46URjKDI7jdn0ZdFMs3h64npPlNRcrem5ckPVJ55rxv%2Fs3XlkADo%2FGQCfajwdfOHJjruZNi6CU7pYfV2h3bJT7kaRjd2DQRrrElCP0bjXFOlURTf%2F7h2f9uVAkJGcyDCv7tpcd70t8wwnktRV1JVY%7Ctkp%3ABk9SR8CIgbTjYA

## Sheet Amplifier.SchDoc
size A3; DocumentNumber: 4; SheetNumber: 4; SheetTotal: 9
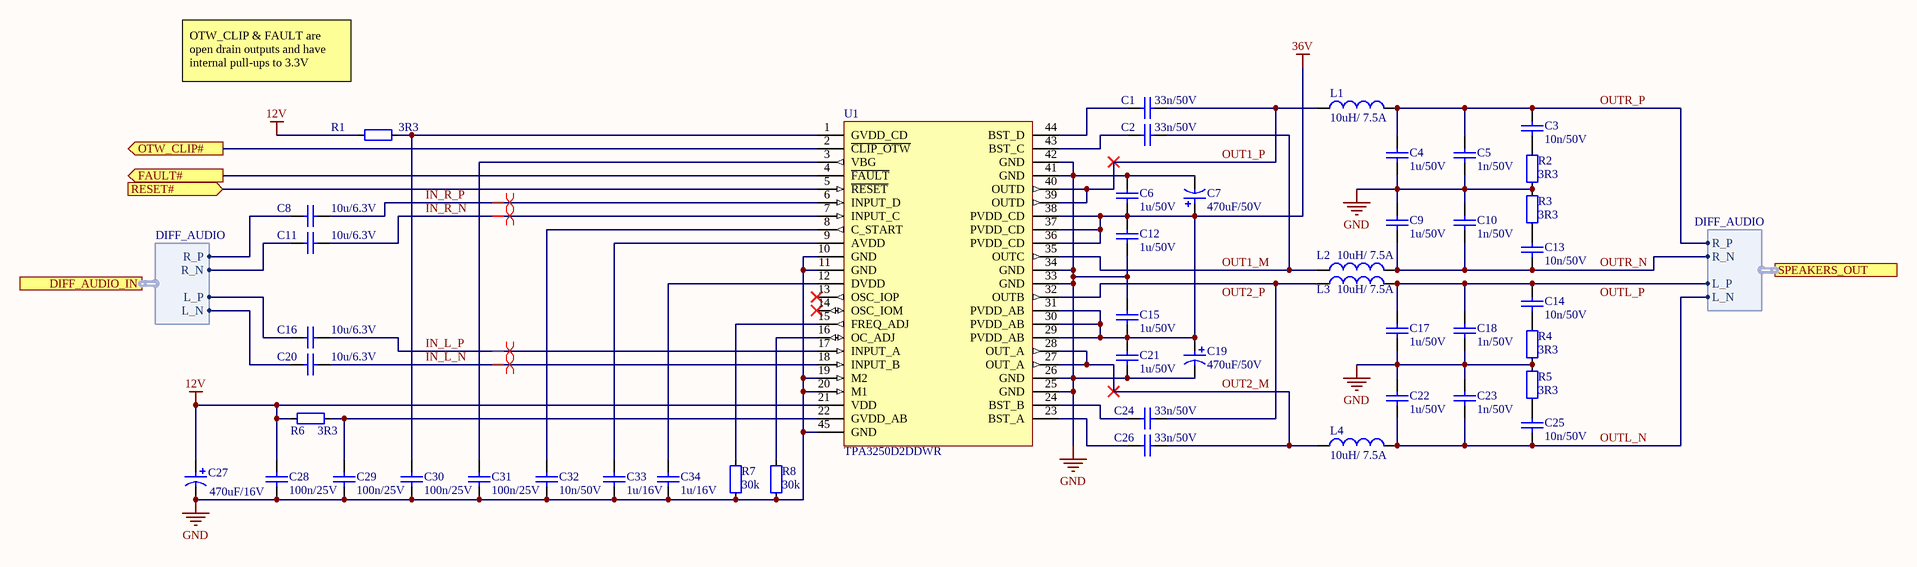
[diagram p5: Amplifier.SchDoc]

### Parts
C1  33n/50V  [C0603]
C2  33n/50V  [C0603]
C3  10n/50V  [C0402]
C4  1u/50V  [C2824]
C5  1n/50V  [C0402]
C6  1u/50V  [C0805]
C7  470uF/50V  [Wurth-L17-D16]
C8  10u/6.3V  [C0805]
C9  1u/50V  [C2824]
C10  1n/50V  [C0402]
C11  10u/6.3V  [C0805]
C12  1u/50V  [C0805]
C13  10n/50V  [C0402]
C14  10n/50V  [C0402]
C15  1u/50V  [C0805]
C16  10u/6.3V  [C0805]
C17  1u/50V  [C2824]
C18  1n/50V  [C0402]
C19  470uF/50V  [Wurth-L17-D16]
C20  10u/6.3V  [C0805]
C21  1u/50V  [C0805]
C22  1u/50V  [C2824]
C23  1n/50V  [C0402]
C24  33n/50V  [C0603]
C25  10n/50V  [C0402]
C26  33n/50V  [C0603]
C27  470uF/16V  [Wurth-L10.5-D8]
C28  100n/25V  [C0402]
C29  100n/25V  [C0402]
C30  100n/25V  [C0402]
C31  100n/25V  [C0402]
C32  10n/50V  [C0402]
C33  1u/16V  [C0603]
C34  1u/16V  [C0603]
L1  10uH/ 7.5A  [PA4342.103NLT]
L2  10uH/ 7.5A  [PA4342.103NLT]
L3  10uH/ 7.5A  [PA4342.103NLT]
L4  10uH/ 7.5A  [PA4342.103NLT]
R1  3R3  [R0402]
R2  3R3  [R0402]
R3  3R3  [R0402]
R4  3R3  [R0402]
R5  3R3  [R0402]
R6  3R3  [R0402]
R7  30k  [R0402]
R8  30k  [R0402]
U1  TPA3250D2DDWR  [HTSSOP-44]

### Ports
DIFF_AUDIO_IN (harness DIFF_AUDIO), FAULT# (out), OTW_CLIP# (out), RESET# (in), SPEAKERS_OUT (harness DIFF_AUDIO)

### Harnesses
DIFF_AUDIO: L_N, L_P, R_N, R_P

### Nets
12V: C27.1 C28.2 R1.2 R6.2 U1.21(VDD)
36V: C6.1 C7.1 C12.2 C15.1 C19.1 C21.2 U1.29(PVDD_AB) U1.30(PVDD_AB) U1.31(PVDD_AB) U1.36(PVDD_CD) U1.37(PVDD_CD) U1.38(PVDD_CD)
GND: C4.1 C5.1 C6.2 C7.2 C9.2 C10.2 C12.1 C15.2 C17.1 C18.1 C19.2 C21.1 C22.2 C23.2 C27.2 C28.1 C29.1 C30.1 C31.1 C32.1 C33.1 C34.1 R2.1 R3.2 R4.1 R5.2 R7.1 R8.1 U1.10(GND) U1.11(GND) U1.19(M2) U1.20(M1) U1.25(GND) U1.26(GND) U1.33(GND) U1.34(GND) U1.41(GND) U1.42(GND) U1.45(GND)
AMP_FAULT#: U1.4(~{FAULT}) ; port FAULT#
AMP_OTW_CLIP#: U1.2(~{CLIP_OTW}) ; port OTW_CLIP#
AMP_RST#: U1.5(~{RESET}) ; port RESET#
IN_L_N: C20.2 U1.18(INPUT_B)  [project net IN_L_N_4]
IN_L_P: C16.2 U1.17(INPUT_A)  [project net IN_L_P_4]
IN_R_N: C11.2 U1.7(INPUT_C)  [project net IN_R_N_4]
IN_R_P: C8.2 U1.6(INPUT_D)  [project net IN_R_P_4]
OUT1_M: C2.2 L2.1 U1.35(OUTC)  [project net OUT1_M_4]
OUT1_P: C1.2 L1.1 U1.39(OUTD) U1.40(OUTD)  [project net OUT1_P_4]
OUT2_M: C26.2 L4.1 U1.27(OUT_A) U1.28(OUT_A)  [project net OUT2_M_4]
OUT2_P: C24.2 L3.1 U1.32(OUTB)  [project net OUT2_P_4]
OUTL_N: C22.1 C23.1 C25.1 L4.2 ; port SPEAKERS_OUT.L_N
OUTL_P: C14.2 C17.2 C18.2 L3.2 ; port SPEAKERS_OUT.L_P
OUTR_N: C9.1 C10.1 C13.1 L2.2 ; port SPEAKERS_OUT.R_N
OUTR_P: C3.2 C4.2 C5.2 L1.2 ; port SPEAKERS_OUT.R_P
NetC1_1: C1.1 U1.44(BST_D)
NetC2_1: C2.1 U1.43(BST_C)
NetC3_1: C3.1 R2.2
NetC8_1: C8.1 ; port DIFF_AUDIO_IN.R_P
NetC11_1: C11.1 ; port DIFF_AUDIO_IN.R_N
NetC13_2: C13.2 R3.1
NetC14_1: C14.1 R4.2
NetC16_1: C16.1 ; port DIFF_AUDIO_IN.L_P
NetC20_1: C20.1 ; port DIFF_AUDIO_IN.L_N
NetC24_1: C24.1 U1.24(BST_B)
NetC25_2: C25.2 R5.1
NetC26_1: C26.1 U1.23(BST_A)
NetC29_2: C29.2 R6.1 U1.22(GVDD_AB)
NetC30_2: C30.2 R1.1 U1.1(GVDD_CD)
NetC31_2: C31.2 U1.3(VBG)
NetC32_2: C32.2 U1.8(C_START)
NetC33_2: C33.2 U1.9(AVDD)
NetC34_2: C34.2 U1.12(DVDD)
NetR7_2: R7.2 U1.15(FREQ_ADJ)
NetR8_2: R8.2 U1.16(OC_ADJ)

Not connected (* = marked no-connect by the designer): U1 13(OSC_IOP)* 14(OSC_IOM)*

### Layout directives
differential pair: IN_L_N_4, IN_L_P_4, IN_R_N_4, IN_R_P_4

### Notes on the sheet
- OTW_CLIP & FAULT are open drain outputs and have internal pull-ups to 3.3V
- Title
- Date:
- Number:
- Revision:
- Sheet
- of
- File:
- Author

### Library data of the parts
C1 C2 C24 C26 = 33n 50V X7R 0603: Manufacturer Part Number 1: 885012206092; Manufacturer 1: Wurth Elektronik; Voltage: 50V; Tolerance: 10%; Specifications: X7R 33n 50V ±10%; Capacitance: 33n; Dielectric: X7R; Supplier 1: Mouser; Supplier Part Number 1: 710-885012206092
C3 C13 C14 C25 C32 = 10n 50V X7R 0402: as C60 on sheet Connectors; Supplier 1: Mouser; Supplier Part Number 1: 710-885012205067
C4 C9 C17 C22 = 1u 50V PET 2824: Manufacturer Part Number 1: CB052D0105JBC; Manufacturer 1: AVX; Voltage: 50V; Tolerance: 5%; Specifications: PET 1u 50V ±5%; Capacitance: 1u; Dielectric: PET; Supplier 1: Mouser; Supplier Part Number 1: 581-CB052D0105J
C5 C10 C18 C23 = 1n 50V X7R 0402: Manufacturer Part Number 1: 885012205061; Manufacturer 1: Wurth Elektronik; Voltage: 50V; Tolerance: 10%; Specifications: X7R 1n 50V ±10%; Capacitance: 1n; Dielectric: X7R; Supplier 1: Mouser; Supplier Part Number 1: 710-885012205061
C6 C12 C15 C21 = 1u 50V X7R 0805: Manufacturer Part Number 1: 08055C105K4T2A; Manufacturer 1: AVX; Voltage: 50V; Tolerance: 10%; Specifications: X7R 1u 50V ±10%; Capacitance: 1u; Dielectric: X7R; Supplier 1: Mouser; Supplier Part Number 1: 581-08055C105K4T2A
C7 C19 = Wurth-470uF-50V-L17-D16: Aluminium Electrolytic Capacitors - SMD WCAP-ASLL 50V 470uF 20% ESR=73mOhms; Manufacturer Part Number 1: 865060663013; Manufacturer 1: Wurth Elektronik; Specifications: 470uF 50V ±20%; ComponentLink1Description: Datasheet; ComponentLink1URL: https://www.mouser.co.uk/datasheet/2/445/865080253012-1075191.pdf; Capacitance: 470uF; Voltage: 50V; Tolerance: 20%; Supplier 1: Mouser; Supplier Part Number 1: 710-865060663013
C8 C11 C16 C20 = 10u 6V3 X7R 0805: as C62 on sheet Connectors; Supplier 1: Mouser; Supplier Part Number 1: 963-JMK212B7106KG-T
C27 = Wurth-470uF-16V-L10.5-D8: Aluminium Electrolytic Capacitors - SMD WCAP-ASLI 470uF 16V 20% SMD/SMT; Manufacturer Part Number 1: 865080353015; Manufacturer 1: Wurth Elektronik; ComponentLink1Description: Datasheet; ComponentLink1URL: https://www.mouser.co.uk/datasheet/2/445/865080353015-1726381.pdf; Capacitance: 470uF; Voltage: 16V; Tolerance: 20%; Specifications: 470uF 16V ±20%; Supplier 1: Mouser; Supplier Part Number 1: 710-865080353015
C28-C31 = 100n 25V X7R 0402: Manufacturer Part Number 1: MC0402B104K250CT; Manufacturer 1: MULTICOMP PRO; Voltage: 25V; Tolerance: 10%; Specifications: X7R 100n 25V ±10%; Capacitance: 100n; Dielectric: X7R; Supplier 1: Farnell; Supplier Part Number 1: 2320759
C33 C34 = 1u 16V X7R 0603: as C46 on sheet Codec; Supplier 1: Mouser; Supplier Part Number 1: 710-885012206052
L1-L4 = PA4342.103NLT: Fixed Inductors 10uH 7.5A 4mm 20% Low Prof; Specifications: 10uH 7.5A 20%; ComponentLink1Description: Datasheet; ComponentLink1URL: https://www.mouser.co.uk/datasheet/2/336/P769-1526786.pdf; Inductance: 10uH; Tolerance: 20%; Current: 7.5A; Manufacturer Part Number: PA4342.103NLT; Supplier 1: Mouser; Supplier Part Number 1: 673-PA4342.103NLT
R1-R6 = 3R3 100mW 50V 0402: Manufacturer Part Number 1: RK73H1ETTP3R30F; Manufacturer 1: KOA Speer; Power Rating: 100mW; Tolerance: 1%; Voltage: 50V; Resistance: 3R3; Specifications: =Resistance+ ' '+"Power Rating "+Voltage+' ±'+Tolerance; Supplier 1: Mouser; Supplier Part Number 1: 660-RK73H1ETTP3R30F
R7 R8 = 30k 63mW 50V 0402: Manufacturer Part Number 1: WR04X3002FTL; Manufacturer 1: WALSIN; Power Rating: 63mW; Tolerance: 1%; Voltage: 50V; Resistance: 30k; Specifications: =Resistance+ ' '+"Power Rating "+Voltage+' ±'+Tolerance; Supplier 1: Farnell; Supplier Part Number 1: 2668211
U1 = TPA3250D2DDWR: TPA3250 70-W Stereo, 130-W peak PurePath™ Ultra-HD Pad Down Class-D Amplifier; Manufacturer 1: Texas Instruments; ComponentLink1Description: Datasheet; ComponentLink1URL: https://www.ti.com/lit/ds/symlink/tpa3250.pdf; Supplier 1: Digi-Key; Supplier Part Number 1: 296-43794-1-ND; Manufacturer Part Number 1: TPA3250D2DDWR